# EAGLE schematic WiFi Pi (EAGLE 9.3.0)

## Sheet 1 of 8: Compute Module 4 Interface
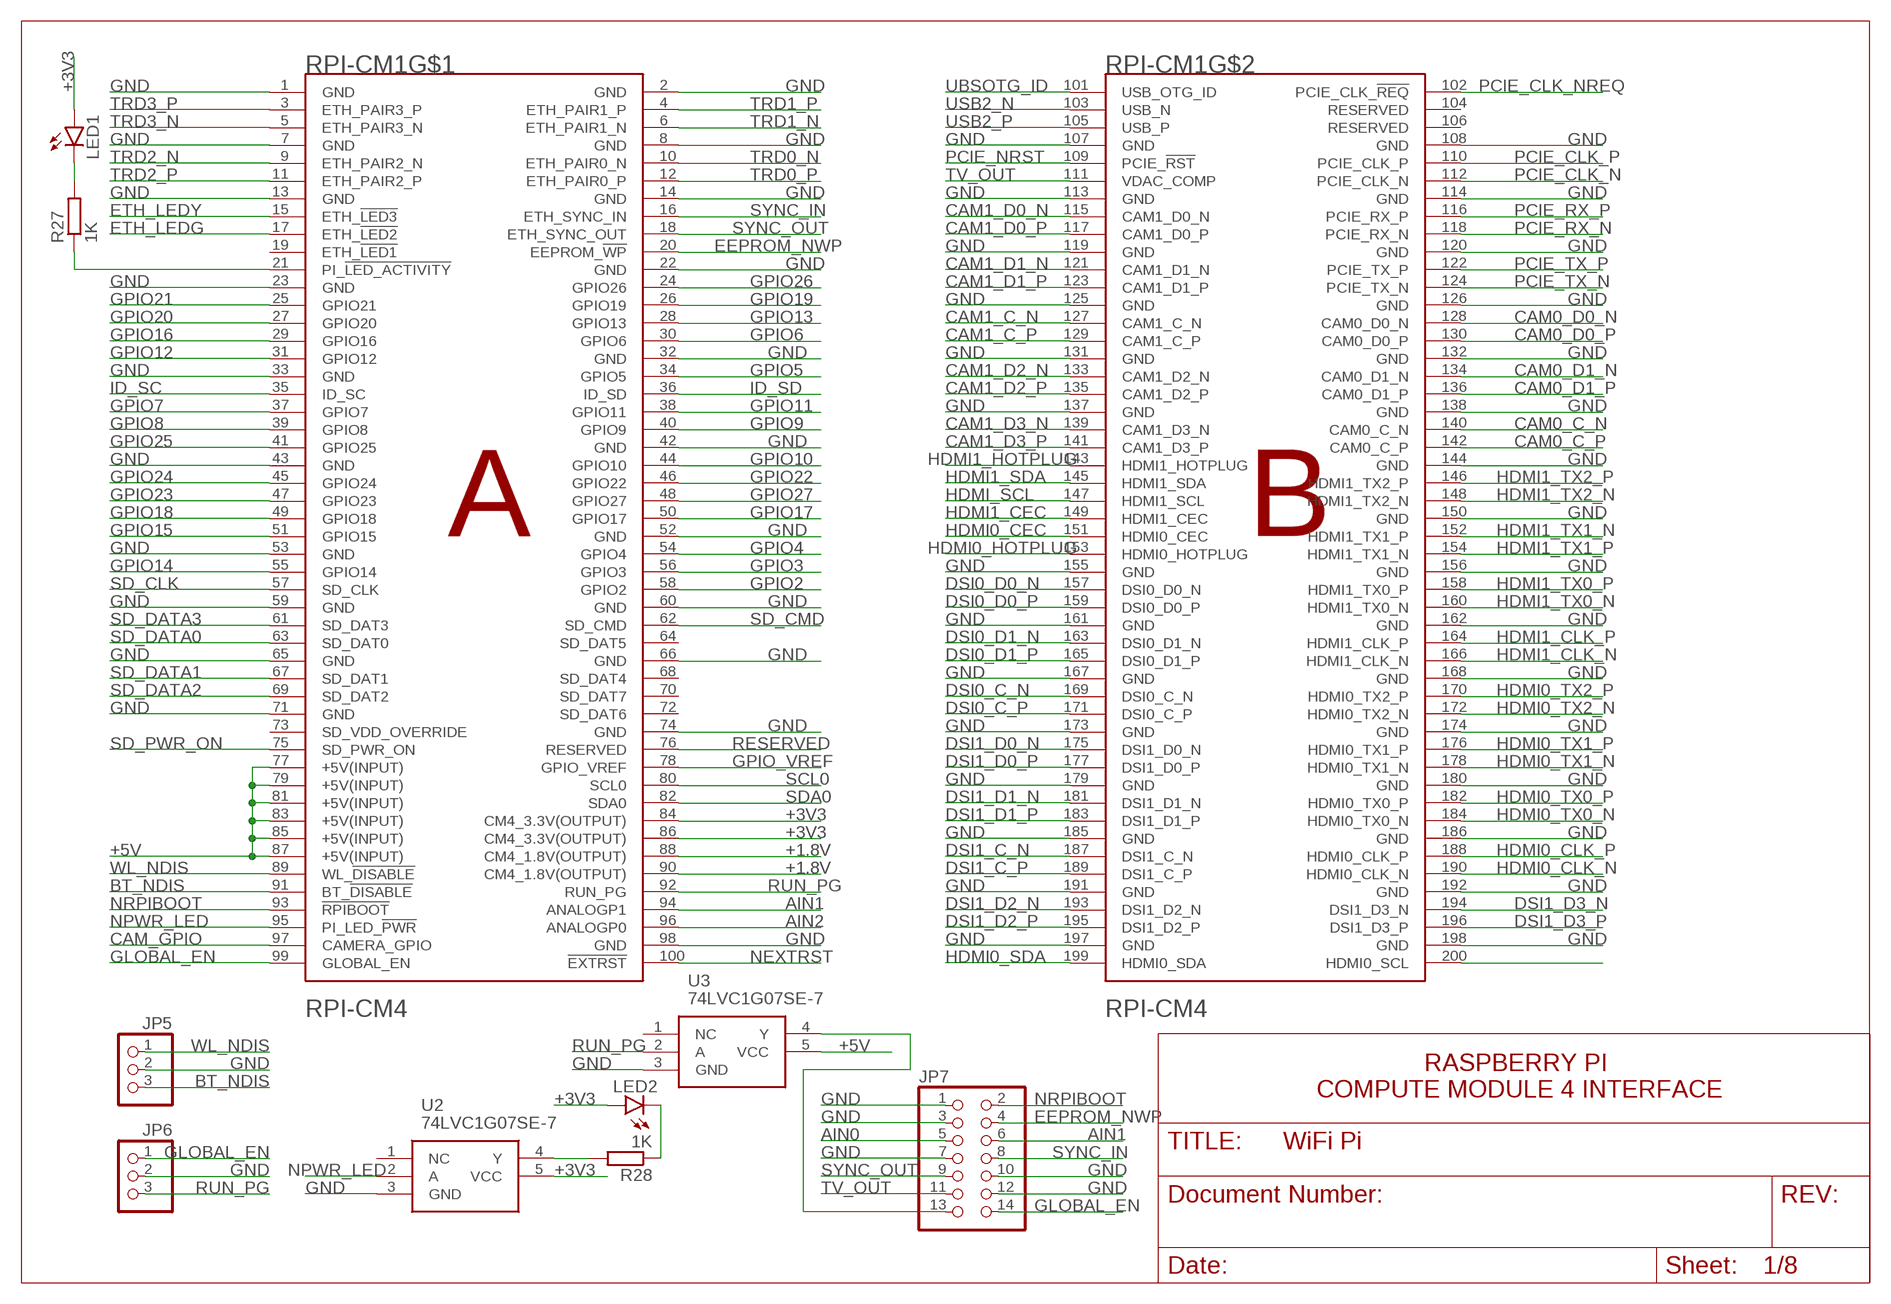
[diagram p0: schematic, sheet 1]

### Parts
JP5  PINHD-1X3  [1X03]
JP6  PINHD-1X3  [1X03]
JP7  PINHD-2X7  [2X07]
LED1  LEDCHIP-LED0805  [CHIP-LED0805]
LED2  LEDCHIP-LED0805  [CHIP-LED0805]
R27  1K  R-EU_M0805  [M0805]
R28  1K  R-EU_M0805  [M0805]
RPI-CM1  RPI-CM4  [RPI-CM4]
U2  74LVC1G07SE-7  [SOT65P210X110-5N]
U3  74LVC1G07SE-7  [SOT65P210X110-5N]

### Nets
+1.8V: RPI-CM1.88(CM4_1.8V(OUTPUT)) RPI-CM1.90(CM4_1.8V(OUTPUT)) ; also sheet 6
+3V3: LED1.A LED2.A RPI-CM1.84(CM4_3.3V(OUTPUT)) RPI-CM1.86(CM4_3.3V(OUTPUT)) U2.5(VCC) ; also sheet 4,5,6,7,8
+5V: RPI-CM1.77(+5V(INPUT)) RPI-CM1.79(+5V(INPUT)) RPI-CM1.81(+5V(INPUT)) RPI-CM1.83(+5V(INPUT)) RPI-CM1.85(+5V(INPUT)) RPI-CM1.87(+5V(INPUT)) U3.5(VCC) ; also sheet 2,5,6
AIN0: JP7.5
AIN1: JP7.6 RPI-CM1.94(ANALOGP1)
AIN2: RPI-CM1.96(ANALOGP0)
BT_NDIS: JP5.3 RPI-CM1.91(BT_!DISABLE)
CAM0_C_N: RPI-CM1.140(CAM0_C_N) ; also sheet 8
CAM0_C_P: RPI-CM1.142(CAM0_C_P) ; also sheet 8
CAM0_D0_N: RPI-CM1.128(CAM0_D0_N) ; also sheet 8
CAM0_D0_P: RPI-CM1.130(CAM0_D0_P) ; also sheet 8
CAM0_D1_N: RPI-CM1.134(CAM0_D1_N) ; also sheet 8
CAM0_D1_P: RPI-CM1.136(CAM0_D1_P) ; also sheet 8
CAM1_C_N: RPI-CM1.127(CAM1_C_N) ; also sheet 8
CAM1_C_P: RPI-CM1.129(CAM1_C_P) ; also sheet 8
CAM1_D0_N: RPI-CM1.115(CAM1_D0_N) ; also sheet 8
CAM1_D0_P: RPI-CM1.117(CAM1_D0_P) ; also sheet 8
CAM1_D1_N: RPI-CM1.121(CAM1_D1_N) ; also sheet 8
CAM1_D1_P: RPI-CM1.123(CAM1_D1_P) ; also sheet 8
CAM1_D2_N: RPI-CM1.133(CAM1_D2_N) ; also sheet 8
CAM1_D2_P: RPI-CM1.135(CAM1_D2_P) ; also sheet 8
CAM1_D3_N: RPI-CM1.139(CAM1_D3_N) ; also sheet 8
CAM1_D3_P: RPI-CM1.141(CAM1_D3_P) ; also sheet 8
CAM_GPIO: RPI-CM1.97(CAMERA_GPIO) ; also sheet 8
DSI0_C_N: RPI-CM1.169(DSI0_C_N) ; also sheet 8
DSI0_C_P: RPI-CM1.171(DSI0_C_P) ; also sheet 8
DSI0_D0_N: RPI-CM1.157(DSI0_D0_N) ; also sheet 8
DSI0_D0_P: RPI-CM1.159(DSI0_D0_P) ; also sheet 8
DSI0_D1_N: RPI-CM1.163(DSI0_D1_N) ; also sheet 8
DSI0_D1_P: RPI-CM1.165(DSI0_D1_P) ; also sheet 8
DSI1_C_N: RPI-CM1.187(DSI1_C_N) ; also sheet 8
DSI1_C_P: RPI-CM1.189(DSI1_C_P) ; also sheet 8
DSI1_D0_N: RPI-CM1.175(DSI1_D0_N) ; also sheet 8
DSI1_D0_P: RPI-CM1.177(DSI1_D0_P) ; also sheet 8
DSI1_D1_N: RPI-CM1.181(DSI1_D1_N) ; also sheet 8
DSI1_D1_P: RPI-CM1.183(DSI1_D1_P) ; also sheet 8
DSI1_D2_N: RPI-CM1.193(DSI1_D2_N) ; also sheet 8
DSI1_D2_P: RPI-CM1.195(DSI1_D2_P) ; also sheet 8
DSI1_D3_N: RPI-CM1.194(DSI1_D3_N) ; also sheet 8
DSI1_D3_P: RPI-CM1.196(DSI1_D3_P) ; also sheet 8
EEPROM_NWP: JP7.4 RPI-CM1.20(EEPROM_!WP)
ETH_LEDG: RPI-CM1.17(ETH_!LED2) ; also sheet 6
ETH_LEDY: RPI-CM1.15(ETH_!LED3) ; also sheet 6
GLOBAL_EN: JP6.1 JP7.14 RPI-CM1.99(GLOBAL_EN)
GND: JP5.2 JP6.2 JP7.1 JP7.3 JP7.7 JP7.10 JP7.12 RPI-CM1.1(GND) RPI-CM1.2(GND) RPI-CM1.7(GND) RPI-CM1.8(GND) RPI-CM1.13(GND) RPI-CM1.14(GND) RPI-CM1.22(GND) RPI-CM1.23(GND) RPI-CM1.32(GND) RPI-CM1.33(GND) RPI-CM1.42(GND) RPI-CM1.43(GND) RPI-CM1.52(GND) RPI-CM1.53(GND) RPI-CM1.59(GND) RPI-CM1.60(GND) RPI-CM1.65(GND) RPI-CM1.66(GND) RPI-CM1.71(GND) RPI-CM1.74(GND) RPI-CM1.98(GND) RPI-CM1.107(GND) RPI-CM1.108(GND) RPI-CM1.113(GND) RPI-CM1.114(GND) RPI-CM1.119(GND) RPI-CM1.120(GND) RPI-CM1.125(GND) RPI-CM1.126(GND) RPI-CM1.131(GND) RPI-CM1.132(GND) RPI-CM1.137(GND) RPI-CM1.138(GND) RPI-CM1.144(GND) RPI-CM1.150(GND) RPI-CM1.155(GND) RPI-CM1.156(GND) RPI-CM1.161(GND) RPI-CM1.162(GND) RPI-CM1.167(GND) RPI-CM1.168(GND) RPI-CM1.173(GND) RPI-CM1.174(GND) RPI-CM1.179(GND) RPI-CM1.180(GND) RPI-CM1.185(GND) RPI-CM1.186(GND) RPI-CM1.191(GND) RPI-CM1.192(GND) RPI-CM1.197(GND) RPI-CM1.198(GND) U2.3(GND) U3.3(GND) ; also sheet 2,4,5,6,7,8
GPIO2: RPI-CM1.58(GPIO2) ; also sheet 6
GPIO3: RPI-CM1.56(GPIO3) ; also sheet 6
GPIO4: RPI-CM1.54(GPIO4) ; also sheet 6
GPIO5: RPI-CM1.34(GPIO5) ; also sheet 6
GPIO6: RPI-CM1.30(GPIO6) ; also sheet 6
GPIO7: RPI-CM1.37(GPIO7) ; also sheet 6
GPIO8: RPI-CM1.39(GPIO8) ; also sheet 6
GPIO9: RPI-CM1.40(GPIO9) ; also sheet 6
GPIO10: RPI-CM1.44(GPIO10) ; also sheet 6
GPIO11: RPI-CM1.38(GPIO11) ; also sheet 6
GPIO12: RPI-CM1.31(GPIO12) ; also sheet 6
GPIO13: RPI-CM1.28(GPIO13) ; also sheet 6
GPIO14: RPI-CM1.55(GPIO14) ; also sheet 6
GPIO15: RPI-CM1.51(GPIO15) ; also sheet 6
GPIO16: RPI-CM1.29(GPIO16) ; also sheet 6
GPIO17: RPI-CM1.50(GPIO17) ; also sheet 6
GPIO18: RPI-CM1.49(GPIO18) ; also sheet 6
GPIO19: RPI-CM1.26(GPIO19) ; also sheet 6
GPIO20: RPI-CM1.27(GPIO20) ; also sheet 6
GPIO21: RPI-CM1.25(GPIO21) ; also sheet 6
GPIO22: RPI-CM1.46(GPIO22) ; also sheet 6
GPIO23: RPI-CM1.47(GPIO23) ; also sheet 6
GPIO24: RPI-CM1.45(GPIO24) ; also sheet 6
GPIO25: RPI-CM1.41(GPIO25) ; also sheet 6
GPIO26: RPI-CM1.24(GPIO26) ; also sheet 6
GPIO27: RPI-CM1.48(GPIO27) ; also sheet 6
GPIO_VREF: RPI-CM1.78(GPIO_VREF) ; also sheet 6,8
HDMI0_CEC: RPI-CM1.151(HDMI0_CEC) ; also sheet 8
HDMI0_CLK_N: RPI-CM1.190(HDMI0_CLK_N)
HDMI0_CLK_P: RPI-CM1.188(HDMI0_CLK_P)
HDMI0_HOTPLUG: RPI-CM1.153(HDMI0_HOTPLUG) ; also sheet 8
HDMI0_SDA: RPI-CM1.199(HDMI0_SDA) ; also sheet 8
HDMI0_TX0_N: RPI-CM1.184(HDMI0_TX0_N)
HDMI0_TX0_P: RPI-CM1.182(HDMI0_TX0_P)
HDMI0_TX1_N: RPI-CM1.178(HDMI0_TX1_N)
HDMI0_TX1_P: RPI-CM1.176(HDMI0_TX1_P)
HDMI0_TX2_N: RPI-CM1.172(HDMI0_TX2_N)
HDMI0_TX2_P: RPI-CM1.170(HDMI0_TX2_P)
HDMI1_CEC: RPI-CM1.149(HDMI1_CEC) ; also sheet 8
HDMI1_CLK_N: RPI-CM1.166(HDMI1_CLK_N)
HDMI1_CLK_P: RPI-CM1.164(HDMI1_CLK_P)
HDMI1_HOTPLUG: RPI-CM1.143(HDMI1_HOTPLUG) ; also sheet 8
HDMI1_SDA: RPI-CM1.145(HDMI1_SDA) ; also sheet 8
HDMI1_TX0_N: RPI-CM1.160(HDMI1_TX0_N)
HDMI1_TX0_P: RPI-CM1.158(HDMI1_TX0_P)
HDMI1_TX1_N: RPI-CM1.152(HDMI1_TX1_P)
HDMI1_TX1_P: RPI-CM1.154(HDMI1_TX1_N)
HDMI1_TX2_N: RPI-CM1.148(HDMI1_TX2_N)
HDMI1_TX2_P: RPI-CM1.146(HDMI1_TX2_P)
HDMI_SCL: RPI-CM1.147(HDMI1_SCL)
ID_SC: RPI-CM1.35(ID_SC) ; also sheet 6,8
ID_SD: RPI-CM1.36(ID_SD) ; also sheet 6,8
N$25: LED1.C R27.2
N$26: R28.2 U2.4(Y)
N$27: LED2.C R28.1
N$34: JP7.13 U3.4(Y)
N$35: R27.1 RPI-CM1.21(PI_!LED_ACTIVITY)
N$72: RPI-CM1.200(HDMI0_SCL)
NEXTRST: RPI-CM1.100(!EXTRST)
NPWR_LED: RPI-CM1.95(PI_LED_!PWR) U2.2(A)
NRPIBOOT: JP7.2 RPI-CM1.93(!RPIBOOT)
PCIE_CLK_N: RPI-CM1.112(PCIE_CLK_N)
PCIE_CLK_NREQ: RPI-CM1.102(PCIE_CLK_!REQ)
PCIE_CLK_P: RPI-CM1.110(PCIE_CLK_P)
PCIE_NRST: RPI-CM1.109(PCIE_!RST)
PCIE_RX_N: RPI-CM1.118(PCIE_RX_N)
PCIE_RX_P: RPI-CM1.116(PCIE_RX_P)
PCIE_TX_N: RPI-CM1.124(PCIE_TX_N)
PCIE_TX_P: RPI-CM1.122(PCIE_TX_P)
RESERVED: RPI-CM1.76(RESERVED) ; also sheet 6
RUN_PG: JP6.3 RPI-CM1.92(RUN_PG) U3.2(A)
SCL0: RPI-CM1.80(SCL0) ; also sheet 8
SD_CLK: RPI-CM1.57(SD_CLK) ; also sheet 6
SD_CMD: RPI-CM1.62(SD_CMD) ; also sheet 6
SD_DATA0: RPI-CM1.63(SD_DAT0)
SD_DATA1: RPI-CM1.67(SD_DAT1)
SD_DATA2: RPI-CM1.69(SD_DAT2)
SD_DATA3: RPI-CM1.61(SD_DAT3)
SD_PWR_ON: RPI-CM1.75(SD_PWR_ON)
SDA0: RPI-CM1.82(SDA0) ; also sheet 8
SYNC_IN: JP7.8 RPI-CM1.16(ETH_SYNC_IN)
SYNC_OUT: JP7.9 RPI-CM1.18(ETH_SYNC_OUT)
TRD0_N: RPI-CM1.10(ETH_PAIR0_N) ; also sheet 6
TRD0_P: RPI-CM1.12(ETH_PAIR0_P) ; also sheet 6
TRD1_N: RPI-CM1.6(ETH_PAIR1_N) ; also sheet 6
TRD1_P: RPI-CM1.4(ETH_PAIR1_P) ; also sheet 6
TRD2_N: RPI-CM1.9(ETH_PAIR2_N) ; also sheet 6
TRD2_P: RPI-CM1.11(ETH_PAIR2_P) ; also sheet 6
TRD3_N: RPI-CM1.5(ETH_PAIR3_N) ; also sheet 6
TRD3_P: RPI-CM1.3(ETH_PAIR3_P) ; also sheet 6
TV_OUT: JP7.11 RPI-CM1.111(VDAC_COMP)
UBSOTG_ID: RPI-CM1.101(USB_OTG_ID)
USB2_N: RPI-CM1.103(USB_N) ; also sheet 5
USB2_P: RPI-CM1.105(USB_P) ; also sheet 5
WL_NDIS: JP5.1 RPI-CM1.89(WL_!DISABLE)
Unconnected: RPI-CM1.19(ETH_!LED1) RPI-CM1.64(SD_DAT5) RPI-CM1.68(SD_DAT4) RPI-CM1.70(SD_DAT7) RPI-CM1.72(SD_DAT6) RPI-CM1.73(SD_VDD_OVERRIDE) RPI-CM1.104(RESERVED) RPI-CM1.106(RESERVED) U2.1(NC) U3.1(NC)

### Notes on the sheet
- RASPBERRY PI 
  COMPUTE MODULE 4 INTERFACE

## Sheet 2 of 8: Power Delivery System
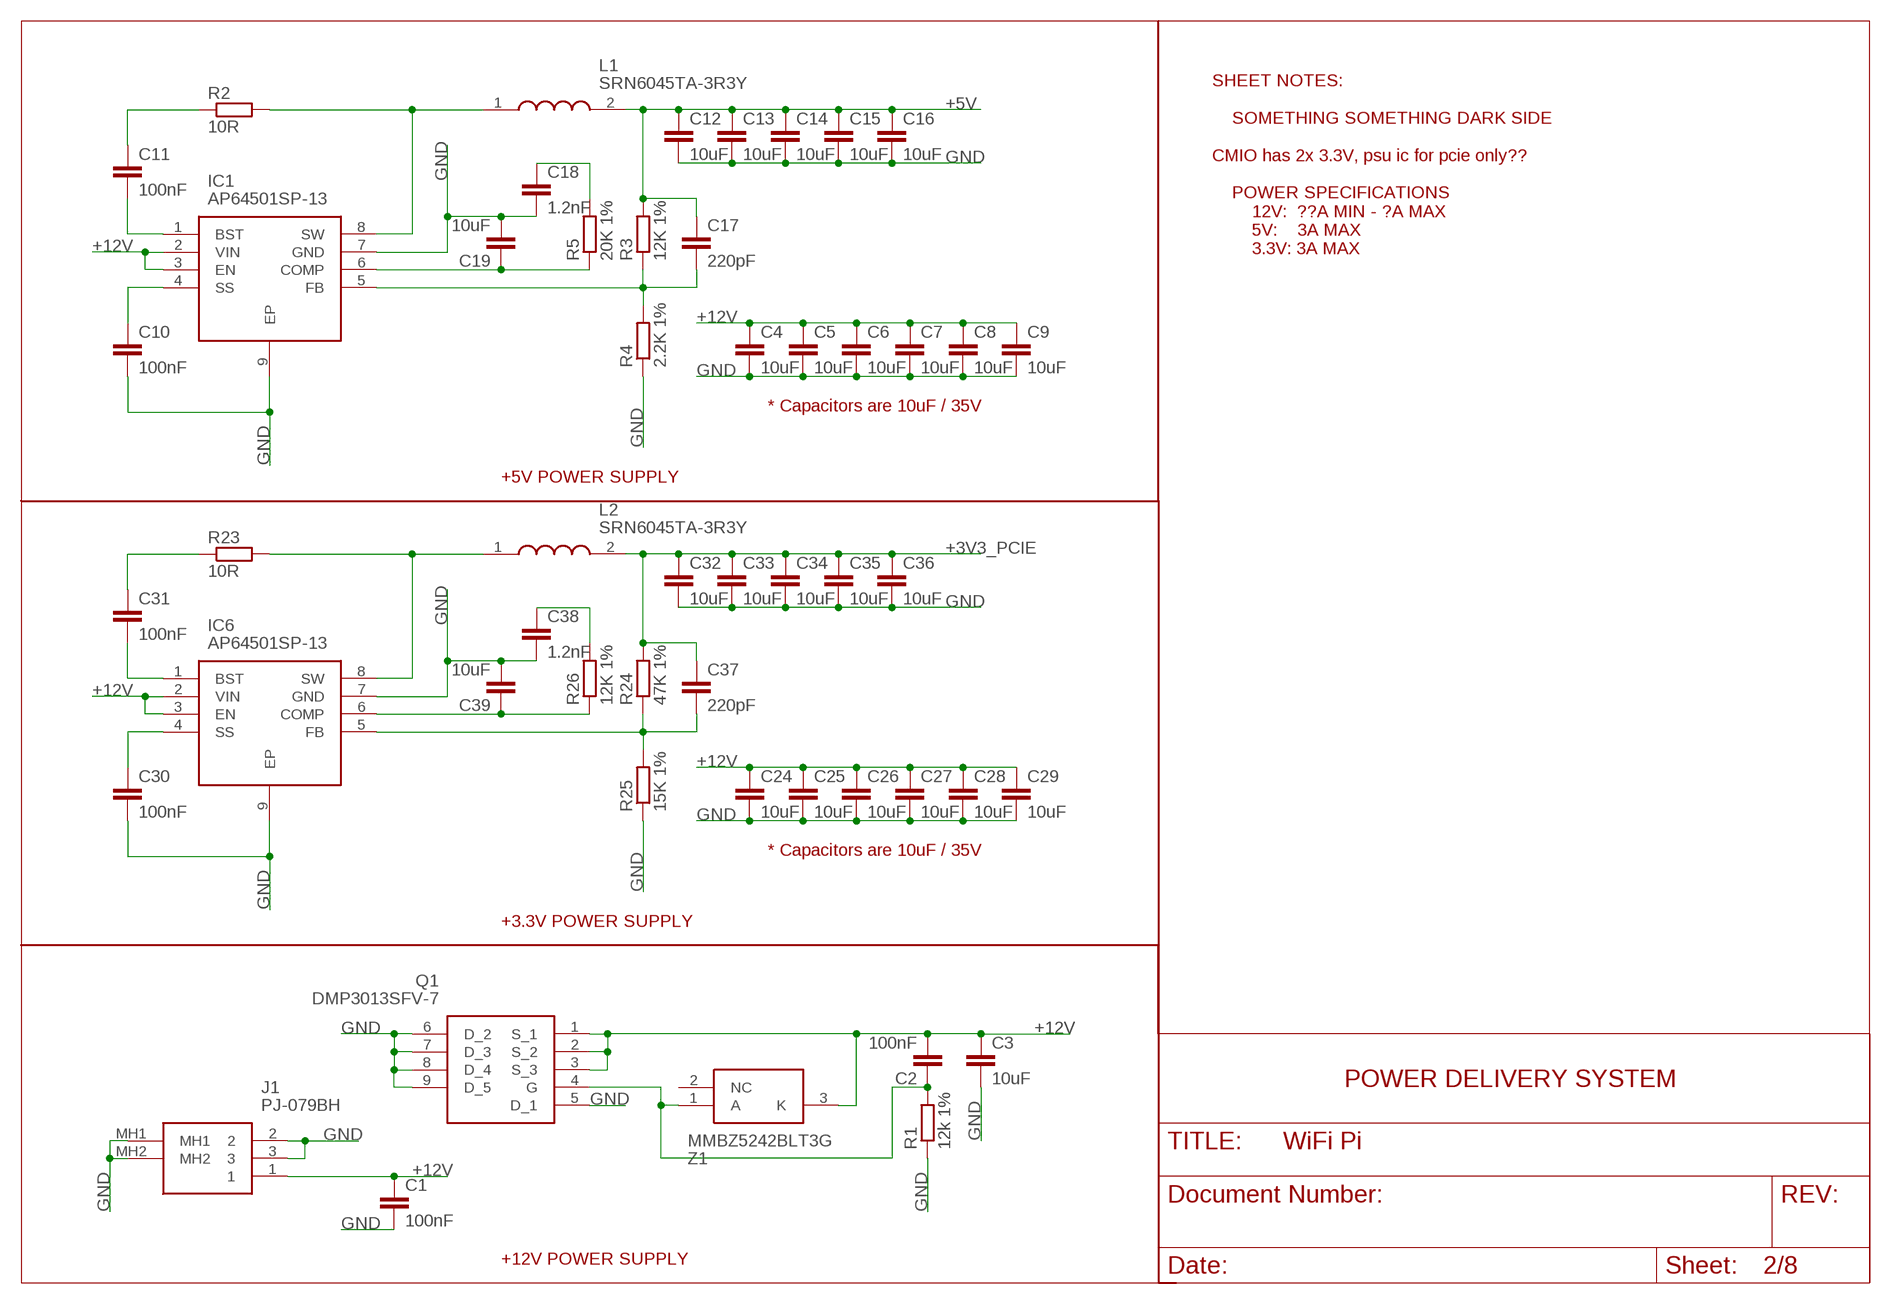
[diagram p1: schematic, sheet 2]

### Parts
C1  100nF  C-EUC0805K  [C0805K]
C2  100nF  C-EUC0805K  [C0805K]
C3  10uF  C-EUC0805K  [C0805K]
C4  10uF  C-EUC0805K  [C0805K]
C5  10uF  C-EUC0805K  [C0805K]
C6  10uF  C-EUC0805K  [C0805K]
C7  10uF  C-EUC0805K  [C0805K]
C8  10uF  C-EUC0805K  [C0805K]
C9  10uF  C-EUC0805K  [C0805K]
C10  100nF  C-EUC0805K  [C0805K]
C11  100nF  C-EUC0805K  [C0805K]
C12  10uF  C-EUC0805K  [C0805K]
C13  10uF  C-EUC0805K  [C0805K]
C14  10uF  C-EUC0805K  [C0805K]
C15  10uF  C-EUC0805K  [C0805K]
C16  10uF  C-EUC0805K  [C0805K]
C17  220pF  C-EUC0805K  [C0805K]
C18  1.2nF  C-EUC0805K  [C0805K]
C19  10uF  C-EUC0805K  [C0805K]
C24  10uF  C-EUC0805K  [C0805K]
C25  10uF  C-EUC0805K  [C0805K]
C26  10uF  C-EUC0805K  [C0805K]
C27  10uF  C-EUC0805K  [C0805K]
C28  10uF  C-EUC0805K  [C0805K]
C29  10uF  C-EUC0805K  [C0805K]
C30  100nF  C-EUC0805K  [C0805K]
C31  100nF  C-EUC0805K  [C0805K]
C32  10uF  C-EUC0805K  [C0805K]
C33  10uF  C-EUC0805K  [C0805K]
C34  10uF  C-EUC0805K  [C0805K]
C35  10uF  C-EUC0805K  [C0805K]
C36  10uF  C-EUC0805K  [C0805K]
C37  220pF  C-EUC0805K  [C0805K]
C38  1.2nF  C-EUC0805K  [C0805K]
C39  10uF  C-EUC0805K  [C0805K]
IC1  AP64501SP-13  [SOIC127P600X163-9N]
IC6  AP64501SP-13  [SOIC127P600X163-9N]
J1  PJ-079BH  [PJ079BH]
L1  SRN6045TA-3R3Y  [SRN6045TA330M]
L2  SRN6045TA-3R3Y  [SRN6045TA330M]
Q1  DMP3013SFV-7  [DMP3013SFV7]
R1  12k 1%  R-EU_M0805  [M0805]
R2  10R  R-EU_M0805  [M0805]
R3  12K 1%  R-EU_M0805  [M0805]
R4  2.2K 1%  R-EU_M0805  [M0805]
R5  20K 1%  R-EU_M0805  [M0805]
R23  10R  R-EU_M0805  [M0805]
R24  47K 1%  R-EU_M0805  [M0805]
R25  15K 1%  R-EU_M0805  [M0805]
R26  12K 1%  R-EU_M0805  [M0805]
Z1  MMBZ5242BLT3G  [SOT96P237X111-3N]

### Nets
+3V3_PCIE: C32.1 C33.1 C34.1 C35.1 C36.1 C37.1 L2.2 R24.2
+5V: C12.1 C13.1 C14.1 C15.1 C16.1 C17.1 L1.2 R3.2 ; also sheet 1,5,6
+12V: C1.1 C2.2 C3.1 C4.1 C5.1 C6.1 C7.1 C8.1 C9.1 C24.1 C25.1 C26.1 C27.1 C28.1 C29.1 IC1.2(VIN) IC1.3(EN) IC6.2(VIN) IC6.3(EN) J1.1 Q1.1(S_1) Q1.2(S_2) Q1.3(S_3) Z1.3(K) ; also sheet 7
GND: C1.2 C3.2 C4.2 C5.2 C6.2 C7.2 C8.2 C9.2 C10.2 C12.2 C13.2 C14.2 C15.2 C16.2 C18.2 C19.2 C24.2 C25.2 C26.2 C27.2 C28.2 C29.2 C30.2 C32.2 C33.2 C34.2 C35.2 C36.2 C38.2 C39.2 IC1.7(GND) IC1.9(EP) IC6.7(GND) IC6.9(EP) J1.2 J1.3 J1.MH1 J1.MH2 Q1.5(D_1) Q1.6(D_2) Q1.7(D_3) Q1.8(D_4) Q1.9(D_5) R1.1 R4.1 R25.1 ; also sheet 1,4,5,6,7,8
N$1: C2.1 Q1.4(G) R1.2 Z1.1(A)
N$2: C10.1 IC1.4(SS)
N$3: C11.2 IC1.1(BST)
N$4: C11.1 R2.1
N$5: IC1.8(SW) L1.1 R2.2
N$6: C19.1 IC1.6(COMP) R5.1
N$7: C17.2 IC1.5(FB) R3.1 R4.2
N$8: C18.1 R5.2
N$15: C30.1 IC6.4(SS)
N$17: C31.2 IC6.1(BST)
N$18: C31.1 R23.1
N$19: IC6.8(SW) L2.1 R23.2
N$20: C37.2 IC6.5(FB) R24.1 R25.2
N$22: C39.1 IC6.6(COMP) R26.1
N$24: C38.1 R26.2
Unconnected: Z1.2(NC)

### Notes on the sheet
- SHEET NOTES:
  
      SOMETHING SOMETHING DARK SIDE
  
  CMIO has 2x 3.3V, psu ic for pcie only??
  
      POWER SPECIFICATIONS
          12V:  ??A MIN - ?A MAX
          5V:    3A MAX
          3.3V: 3A MAX
- * Capacitors are 10uF / 35V
- +5V POWER SUPPLY
- * Capacitors are 10uF / 35V
- +3.3V POWER SUPPLY
- POWER DELIVERY SYSTEM
- +12V POWER SUPPLY

## Sheet 3 of 8: PCI-Express
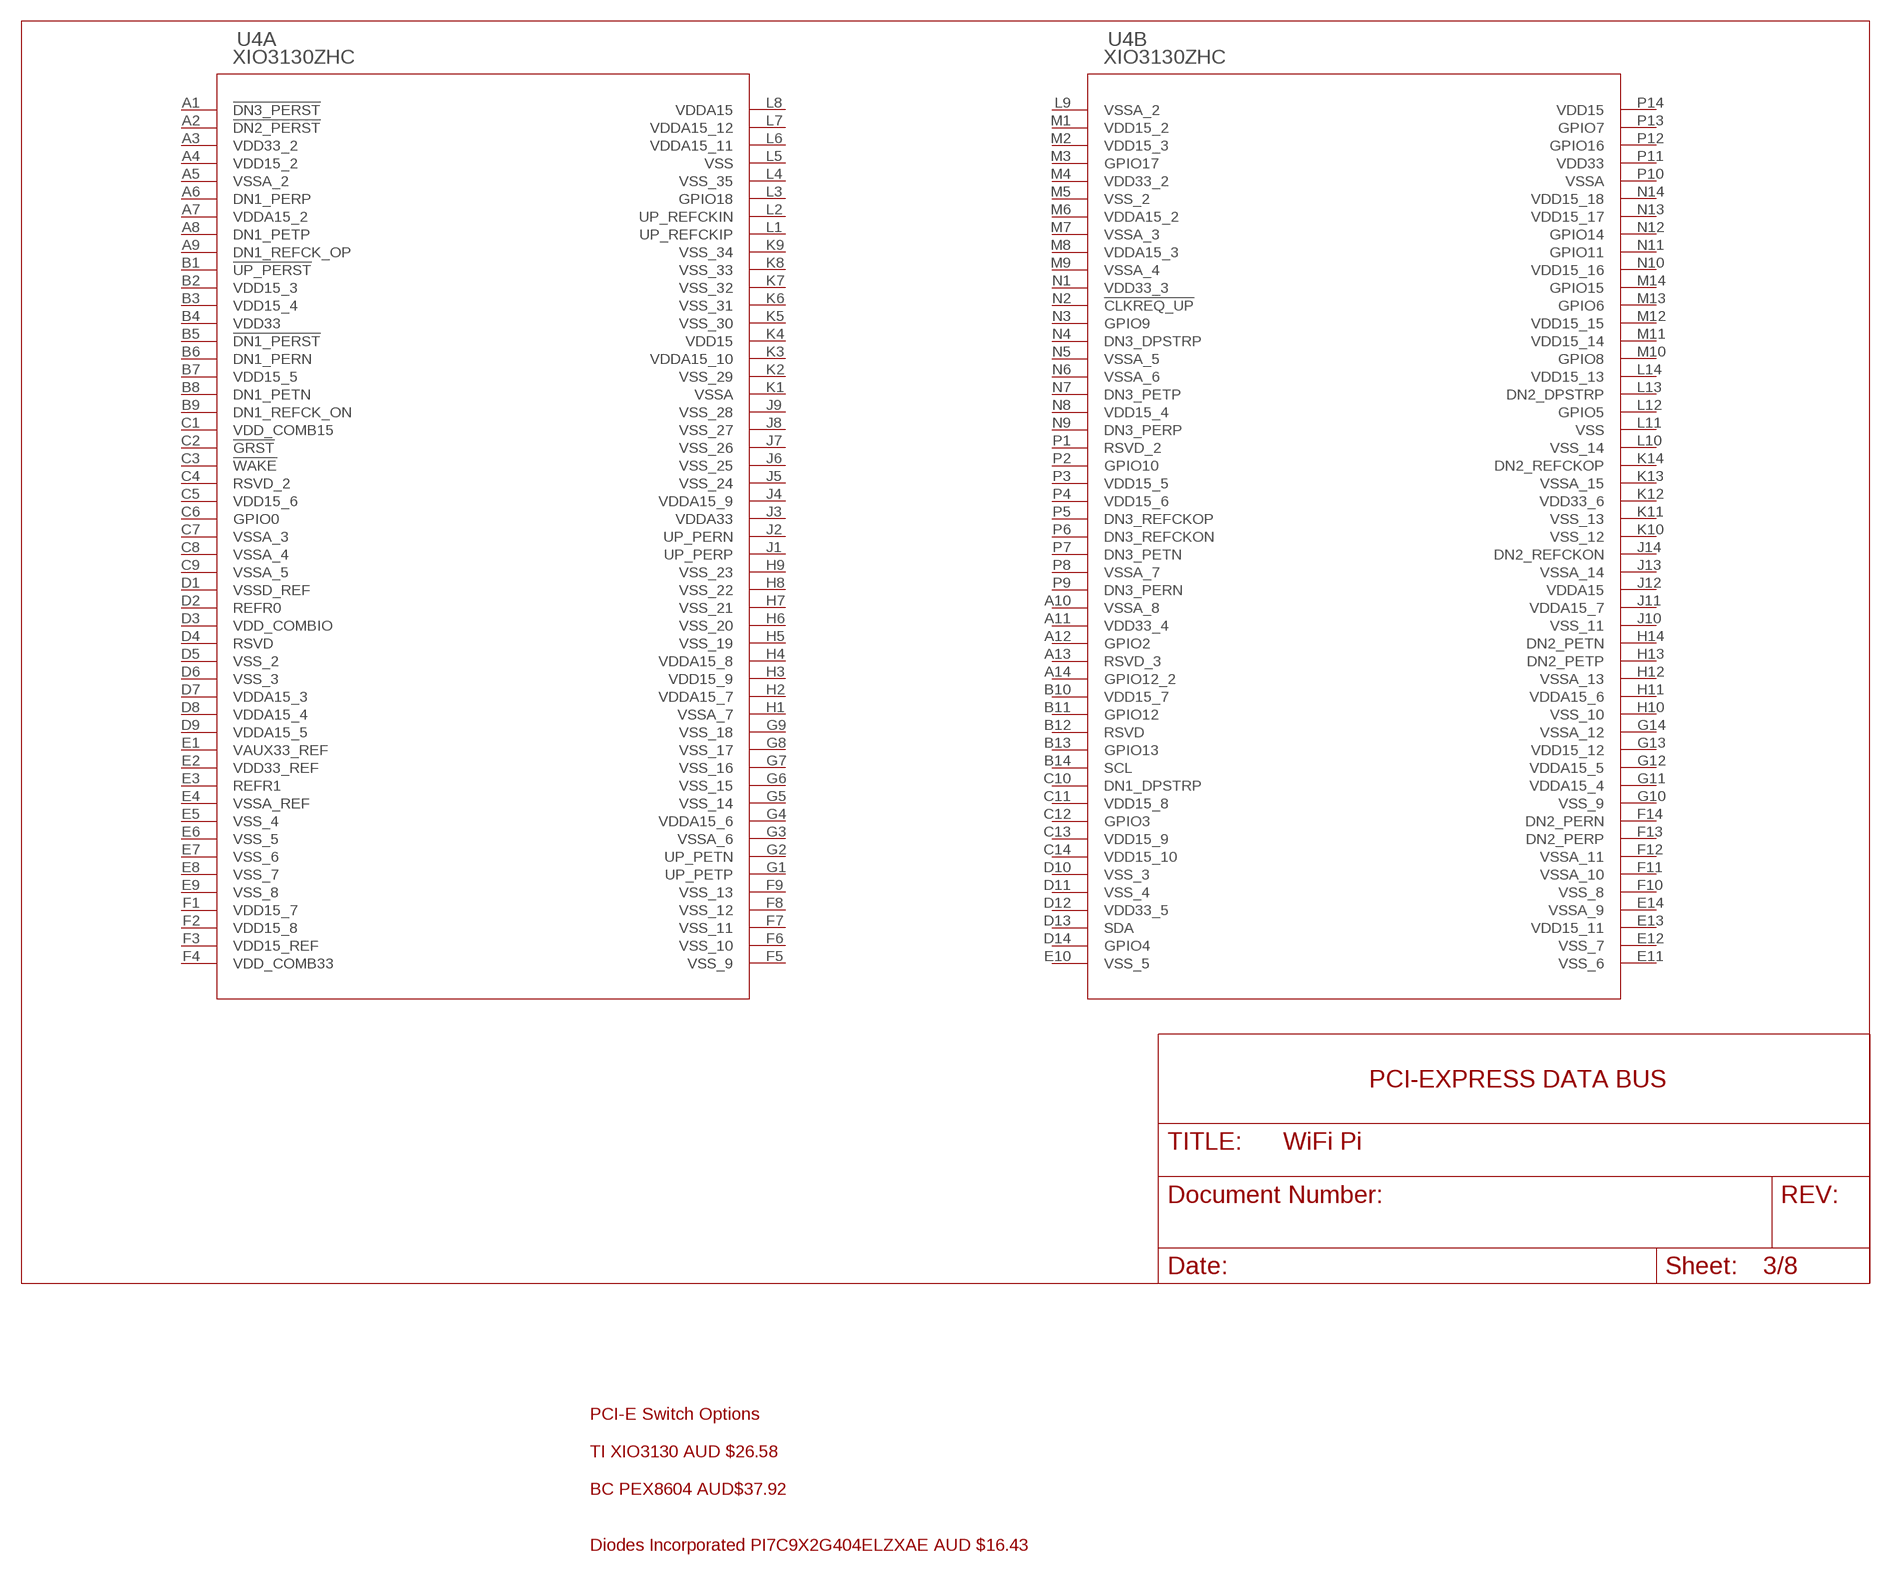
[diagram p2: schematic, sheet 3]

### Parts
U4  XIO3130ZHC  [ZHC196]
Unconnected: U4.A1(A:!DN3_PERST) U4.A2(A:!DN2_PERST) U4.A6(A:DN1_PERP) U4.A8(A:DN1_PETP) U4.A9(A:DN1_REFCK_OP) U4.A12(B:GPIO2) U4.A13(B:RSVD_3) U4.A14(B:GPIO12_2) U4.B1(A:!UP_PERST) U4.B5(A:!DN1_PERST) U4.B6(A:DN1_PERN) U4.B8(A:DN1_PETN) U4.B9(A:DN1_REFCK_ON) U4.B11(B:GPIO12) U4.B12(B:RSVD) U4.B13(B:GPIO13) U4.B14(B:SCL) U4.C2(A:!GRST) U4.C3(A:!WAKE) U4.C4(A:RSVD_2) U4.C6(A:GPIO0) U4.C10(B:DN1_DPSTRP) U4.C12(B:GPIO3) U4.D2(A:REFR0) U4.D4(A:RSVD) U4.D13(B:SDA) U4.D14(B:GPIO4) U4.E3(A:REFR1) U4.F13(B:DN2_PERP) U4.F14(B:DN2_PERN) U4.G1(A:UP_PETP) U4.G2(A:UP_PETN) U4.H13(B:DN2_PETP) U4.H14(B:DN2_PETN) U4.J1(A:UP_PERP) U4.J2(A:UP_PERN) U4.J14(B:DN2_REFCKON) U4.K14(B:DN2_REFCKOP) U4.L1(A:UP_REFCKIP) U4.L2(A:UP_REFCKIN) U4.L3(A:GPIO18) U4.L12(B:GPIO5) U4.L13(B:DN2_DPSTRP) U4.M3(B:GPIO17) U4.M10(B:GPIO8) U4.M13(B:GPIO6) U4.M14(B:GPIO15) U4.N2(B:!CLKREQ_UP) U4.N3(B:GPIO9) U4.N4(B:DN3_DPSTRP) U4.N7(B:DN3_PETP) U4.N9(B:DN3_PERP) U4.N11(B:GPIO11) U4.N12(B:GPIO14) U4.P1(B:RSVD_2) U4.P2(B:GPIO10) U4.P5(B:DN3_REFCKOP) U4.P6(B:DN3_REFCKON) U4.P7(B:DN3_PETN) U4.P9(B:DN3_PERN) U4.P12(B:GPIO16) U4.P13(B:GPIO7)

### Notes on the sheet
- PCI-EXPRESS DATA BUS
- PCI-E Switch Options
  
  TI XIO3130 AUD $26.58 
  
  BC PEX8604 AUD$37.92
  
  
  Diodes Incorporated PI7C9X2G404ELZXAE AUD $16.43

## Sheet 4 of 8: M.2 Interface
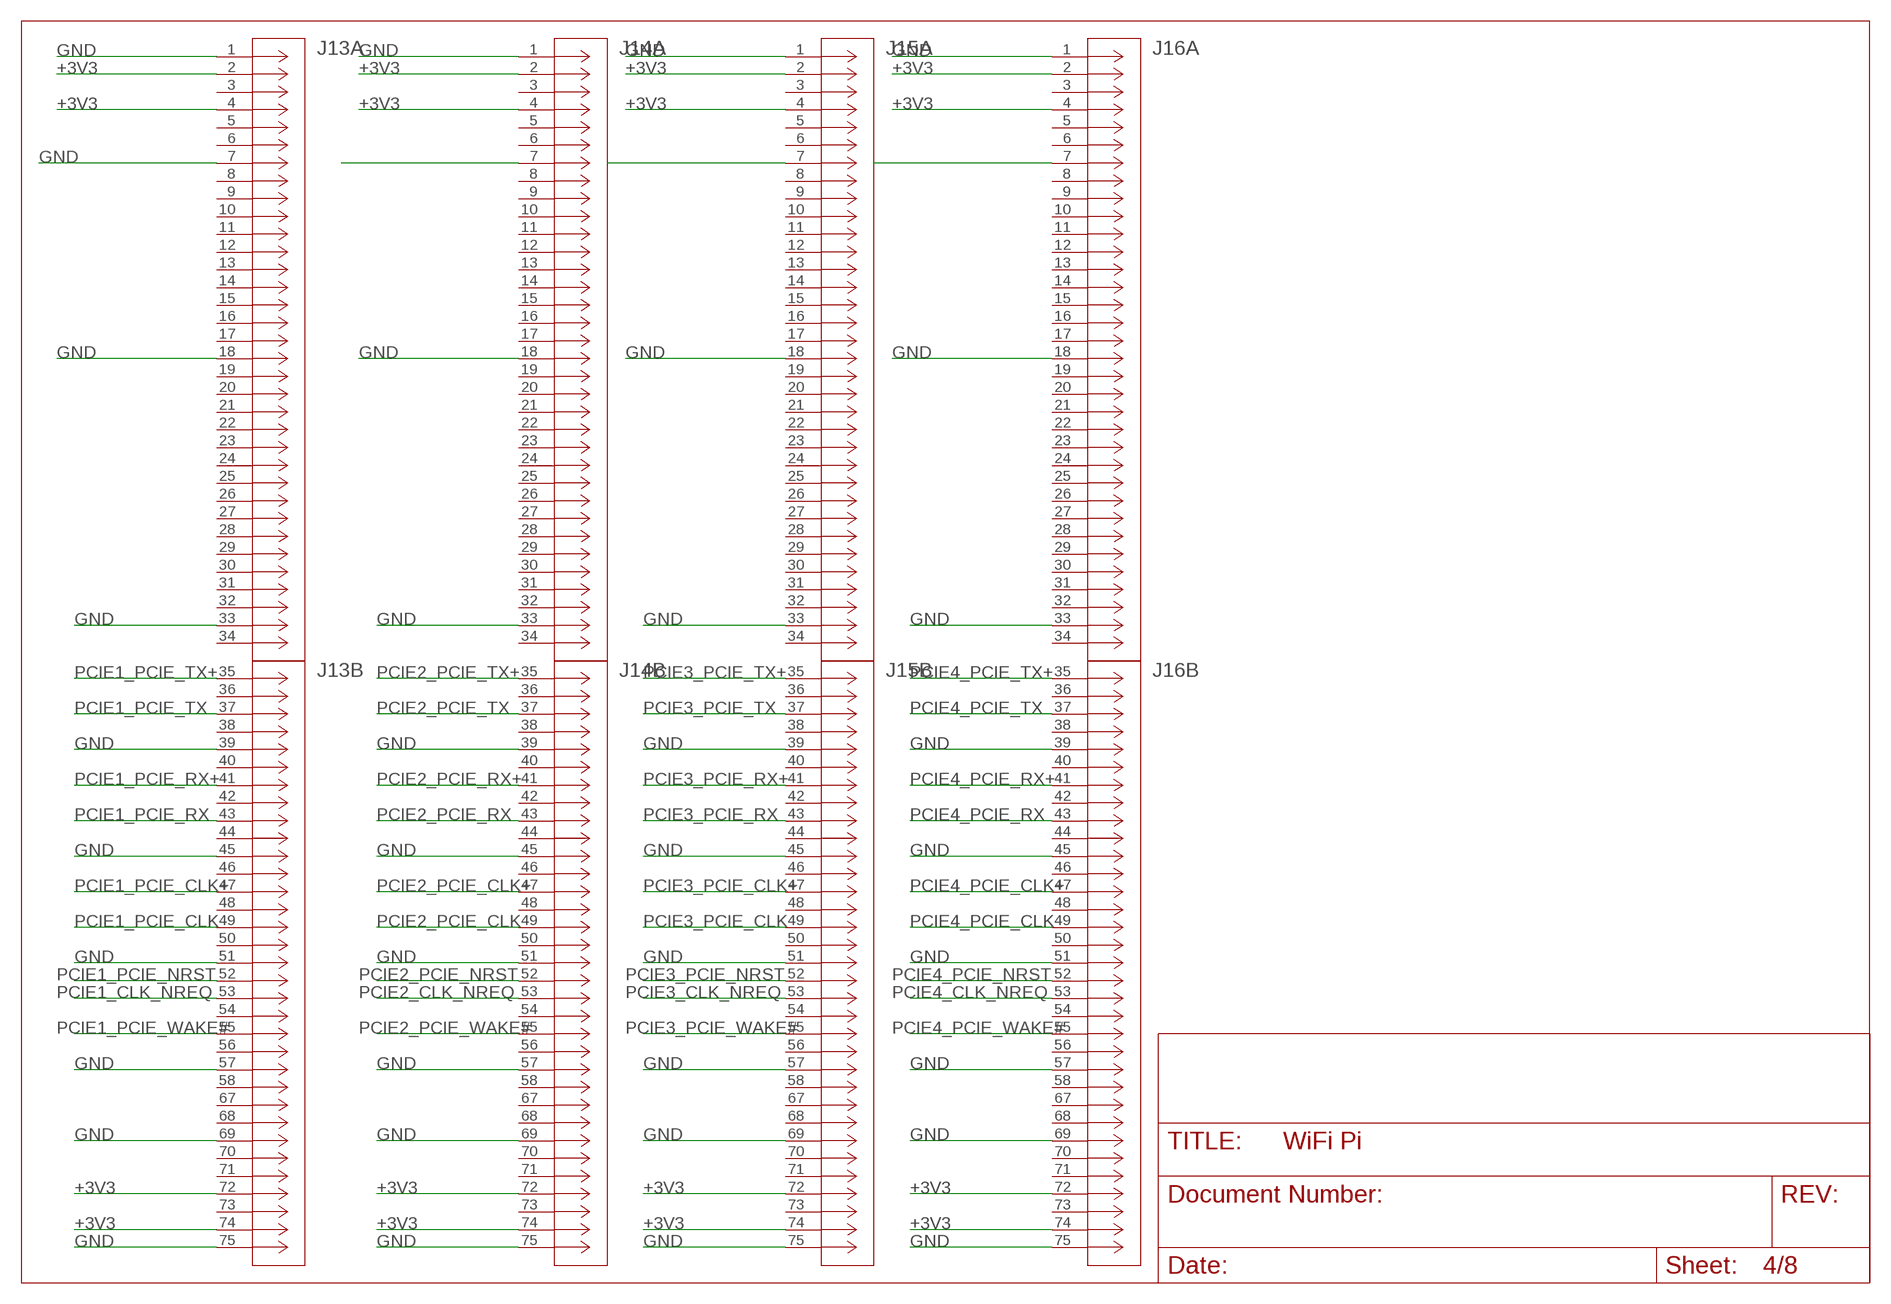
[diagram p3: schematic, sheet 4]

### Parts
J13  2199230-2  [CONN67_2199230_TEC]
J14  2199230-2  [CONN67_2199230_TEC]
J15  2199230-2  [CONN67_2199230_TEC]
J16  2199230-2  [CONN67_2199230_TEC]

### Nets
+3V3: J13.2 J13.4 J13.72 J13.74 J14.2 J14.4 J14.72 J14.74 J15.2 J15.4 J15.72 J15.74 J16.2 J16.4 J16.72 J16.74 ; also sheet 1,5,6,7,8
GND: J13.1 J13.7 J13.18 J13.33 J13.39 J13.45 J13.51 J13.57 J13.69 J13.75 J14.1 J14.7 J14.18 J14.33 J14.39 J14.45 J14.51 J14.57 J14.69 J14.75 J15.1 J15.7 J15.18 J15.33 J15.39 J15.45 J15.51 J15.57 J15.69 J15.75 J16.1 J16.7 J16.18 J16.33 J16.39 J16.45 J16.51 J16.57 J16.69 J16.75 ; also sheet 1,2,5,6,7,8
PCIE1_CLK_NREQ: J13.53
PCIE1_PCIE_CLK: J13.49
PCIE1_PCIE_CLK+: J13.47
PCIE1_PCIE_NRST: J13.52
PCIE1_PCIE_RX: J13.43
PCIE1_PCIE_RX+: J13.41
PCIE1_PCIE_TX: J13.37
PCIE1_PCIE_TX+: J13.35
PCIE1_PCIE_WAKE#: J13.55
PCIE2_CLK_NREQ: J14.53
PCIE2_PCIE_CLK: J14.49
PCIE2_PCIE_CLK+: J14.47
PCIE2_PCIE_NRST: J14.52
PCIE2_PCIE_RX: J14.43
PCIE2_PCIE_RX+: J14.41
PCIE2_PCIE_TX: J14.37
PCIE2_PCIE_TX+: J14.35
PCIE2_PCIE_WAKE#: J14.55
PCIE3_CLK_NREQ: J15.53
PCIE3_PCIE_CLK: J15.49
PCIE3_PCIE_CLK+: J15.47
PCIE3_PCIE_NRST: J15.52
PCIE3_PCIE_RX: J15.43
PCIE3_PCIE_RX+: J15.41
PCIE3_PCIE_TX: J15.37
PCIE3_PCIE_TX+: J15.35
PCIE3_PCIE_WAKE#: J15.55
PCIE4_CLK_NREQ: J16.53
PCIE4_PCIE_CLK: J16.49
PCIE4_PCIE_CLK+: J16.47
PCIE4_PCIE_NRST: J16.52
PCIE4_PCIE_RX: J16.43
PCIE4_PCIE_RX+: J16.41
PCIE4_PCIE_TX: J16.37
PCIE4_PCIE_TX+: J16.35
PCIE4_PCIE_WAKE#: J16.55
Unconnected: J13.3 J13.5 J13.6 J13.8 J13.9 J13.10 J13.11 J13.12 J13.13 J13.14 J13.15 J13.16 J13.17 J13.19 J13.20 J13.21 J13.22 J13.23 J13.24 J13.25 J13.26 J13.27 J13.28 J13.29 J13.30 J13.31 J13.32 J13.34 J13.36 J13.38 J13.40 J13.42 J13.44 J13.46 J13.48 J13.50 J13.54 J13.56 J13.58 J13.67 J13.68 J13.70 J13.71 J13.73 J14.3 J14.5 J14.6 J14.8 J14.9 J14.10 J14.11 J14.12 J14.13 J14.14 J14.15 J14.16 J14.17 J14.19 J14.20 J14.21 J14.22 J14.23 J14.24 J14.25 J14.26 J14.27 J14.28 J14.29 J14.30 J14.31 J14.32 J14.34 J14.36 J14.38 J14.40 J14.42 J14.44 J14.46 J14.48 J14.50 J14.54 J14.56 J14.58 J14.67 J14.68 J14.70 J14.71 J14.73 J15.3 J15.5 J15.6 J15.8 J15.9 J15.10 J15.11 J15.12 J15.13 J15.14 J15.15 J15.16 J15.17 J15.19 J15.20 J15.21 J15.22 J15.23 J15.24 J15.25 J15.26 J15.27 J15.28 J15.29 J15.30 J15.31 J15.32 J15.34 J15.36 J15.38 J15.40 J15.42 J15.44 J15.46 J15.48 J15.50 J15.54 J15.56 J15.58 J15.67 J15.68 J15.70 J15.71 J15.73 J16.3 J16.5 J16.6 J16.8 J16.9 J16.10 J16.11 J16.12 J16.13 J16.14 J16.15 J16.16 J16.17 J16.19 J16.20 J16.21 J16.22 J16.23 J16.24 J16.25 J16.26 J16.27 J16.28 J16.29 J16.30 J16.31 J16.32 J16.34 J16.36 J16.38 J16.40 J16.42 J16.44 J16.46 J16.48 J16.50 J16.54 J16.56 J16.58 J16.67 J16.68 J16.70 J16.71 J16.73

## Sheet 5 of 8: USB Interface
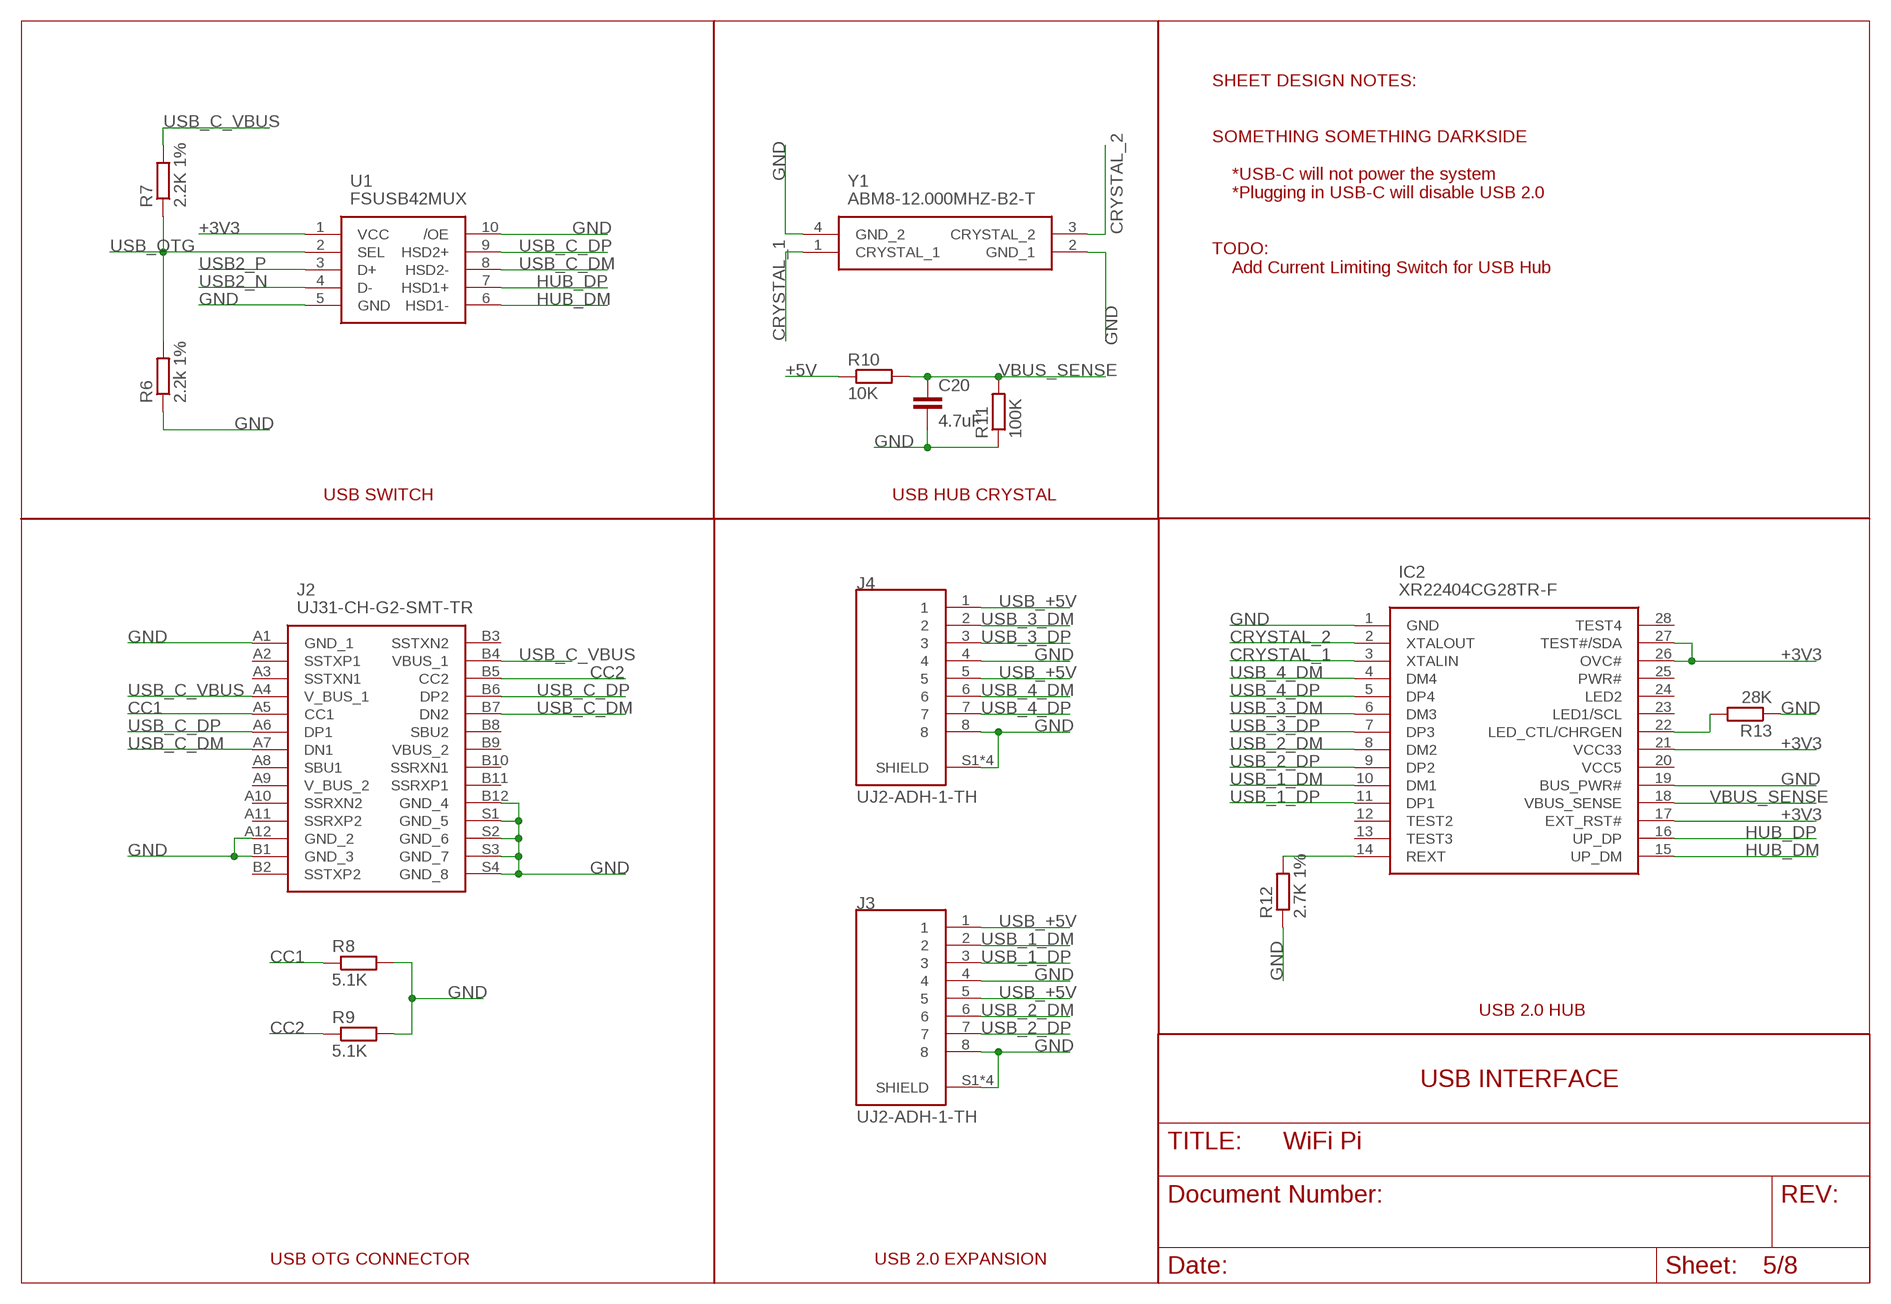
[diagram p4: schematic, sheet 5]

### Parts
C20  4.7uF  C-EUC0805K  [C0805K]
IC2  XR22404CG28TR-F  [SOP64P600X173-28N]
J2  UJ31-CH-G2-SMT-TR  [UJ31CHG2SMTTR]
J3  UJ2-ADH-1-TH  [CUI_UJ2-ADH-1-TH]
J4  UJ2-ADH-1-TH  [CUI_UJ2-ADH-1-TH]
R6  2.2k 1%  R-EU_M0805  [M0805]
R7  2.2K 1%  R-EU_M0805  [M0805]
R8  5.1K  R-EU_M0805  [M0805]
R9  5.1K  R-EU_M0805  [M0805]
R10  10K  R-EU_M0805  [M0805]
R11  100K  R-EU_M0805  [M0805]
R12  2.7K 1%  R-EU_M0805  [M0805]
R13  28K  R-EU_M0805  [M0805]
U1  FSUSB42MUX  [SOP50P490X110-10N]
Y1  ABM8-12.000MHZ-B2-T  [ABM812000MHZB2T]

### Nets
+3V3: IC2.17(EXT_RST#) IC2.21(VCC33) IC2.26(OVC#) IC2.27(TEST#/SDA) U1.1(VCC) ; also sheet 1,4,6,7,8
+5V: R10.1 ; also sheet 1,2,6
CC1: J2.A5(CC1) R8.1
CC2: J2.B5(CC2) R9.1
CRYSTAL_1: IC2.3(XTALIN) Y1.1(CRYSTAL_1)
CRYSTAL_2: IC2.2(XTALOUT) Y1.3(CRYSTAL_2)
GND: C20.2 IC2.1(GND) IC2.19(BUS_PWR#) J2.A1(GND_1) J2.A12(GND_2) J2.B1(GND_3) J2.B12(GND_4) J2.S1(GND_5) J2.S2(GND_6) J2.S3(GND_7) J2.S4(GND_8) J3.4 J3.8 J3.S1(SHIELD) J3.S2(SHIELD) J3.S3(SHIELD) J3.S4(SHIELD) J4.4 J4.8 J4.S1(SHIELD) J4.S2(SHIELD) J4.S3(SHIELD) J4.S4(SHIELD) R6.1 R8.2 R9.2 R11.1 R12.1 R13.1 U1.5(GND) U1.10(/OE) Y1.2(GND_1) Y1.4(GND_2) ; also sheet 1,2,4,6,7,8
HUB_DM: IC2.15(UP_DM) U1.6(HSD1-)
HUB_DP: IC2.16(UP_DP) U1.7(HSD1+)
N$21: IC2.14(REXT) R12.2
N$23: IC2.22(LED_CTL/CHRGEN) R13.2
USB2_N: U1.4(D-) ; also sheet 1
USB2_P: U1.3(D+) ; also sheet 1
USB_1_DM: IC2.10(DM1) J3.2
USB_1_DP: IC2.11(DP1) J3.3
USB_2_DM: IC2.8(DM2) J3.6
USB_2_DP: IC2.9(DP2) J3.7
USB_3_DM: IC2.6(DM3) J4.2
USB_3_DP: IC2.7(DP3) J4.3
USB_4_DM: IC2.4(DM4) J4.6
USB_4_DP: IC2.5(DP4) J4.7
USB_+5V: J3.1 J3.5 J4.1 J4.5
USB_C_DM: J2.A7(DN1) J2.B7(DN2) U1.8(HSD2-)
USB_C_DP: J2.A6(DP1) J2.B6(DP2) U1.9(HSD2+)
USB_C_VBUS: J2.A4(V_BUS_1) J2.B4(VBUS_1) R7.2
USB_OTG: R6.2 R7.1 U1.2(SEL)
VBUS_SENSE: C20.1 IC2.18(VBUS_SENSE) R10.2 R11.2
Unconnected: IC2.12(TEST2) IC2.13(TEST3) IC2.20(VCC5) IC2.23(LED1/SCL) IC2.24(LED2) IC2.25(PWR#) IC2.28(TEST4) J2.A2(SSTXP1) J2.A3(SSTXN1) J2.A8(SBU1) J2.A9(V_BUS_2) J2.A10(SSRXN2) J2.A11(SSRXP2) J2.B2(SSTXP2) J2.B3(SSTXN2) J2.B8(SBU2) J2.B9(VBUS_2) J2.B10(SSRXN1) J2.B11(SSRXP1)

### Notes on the sheet
- SHEET DESIGN NOTES:
  
  
  SOMETHING SOMETHING DARKSIDE
  
      *USB-C will not power the system
      *Plugging in USB-C will disable USB 2.0
  
  
  TODO:
      Add Current Limiting Switch for USB Hub
- USB SWITCH | USB HUB CRYSTAL
- USB 2.0 HUB
- USB INTERFACE
- USB OTG CONNECTOR | USB 2.0 EXPANSION

## Sheet 6 of 8: SD, Ethernet, GPIO
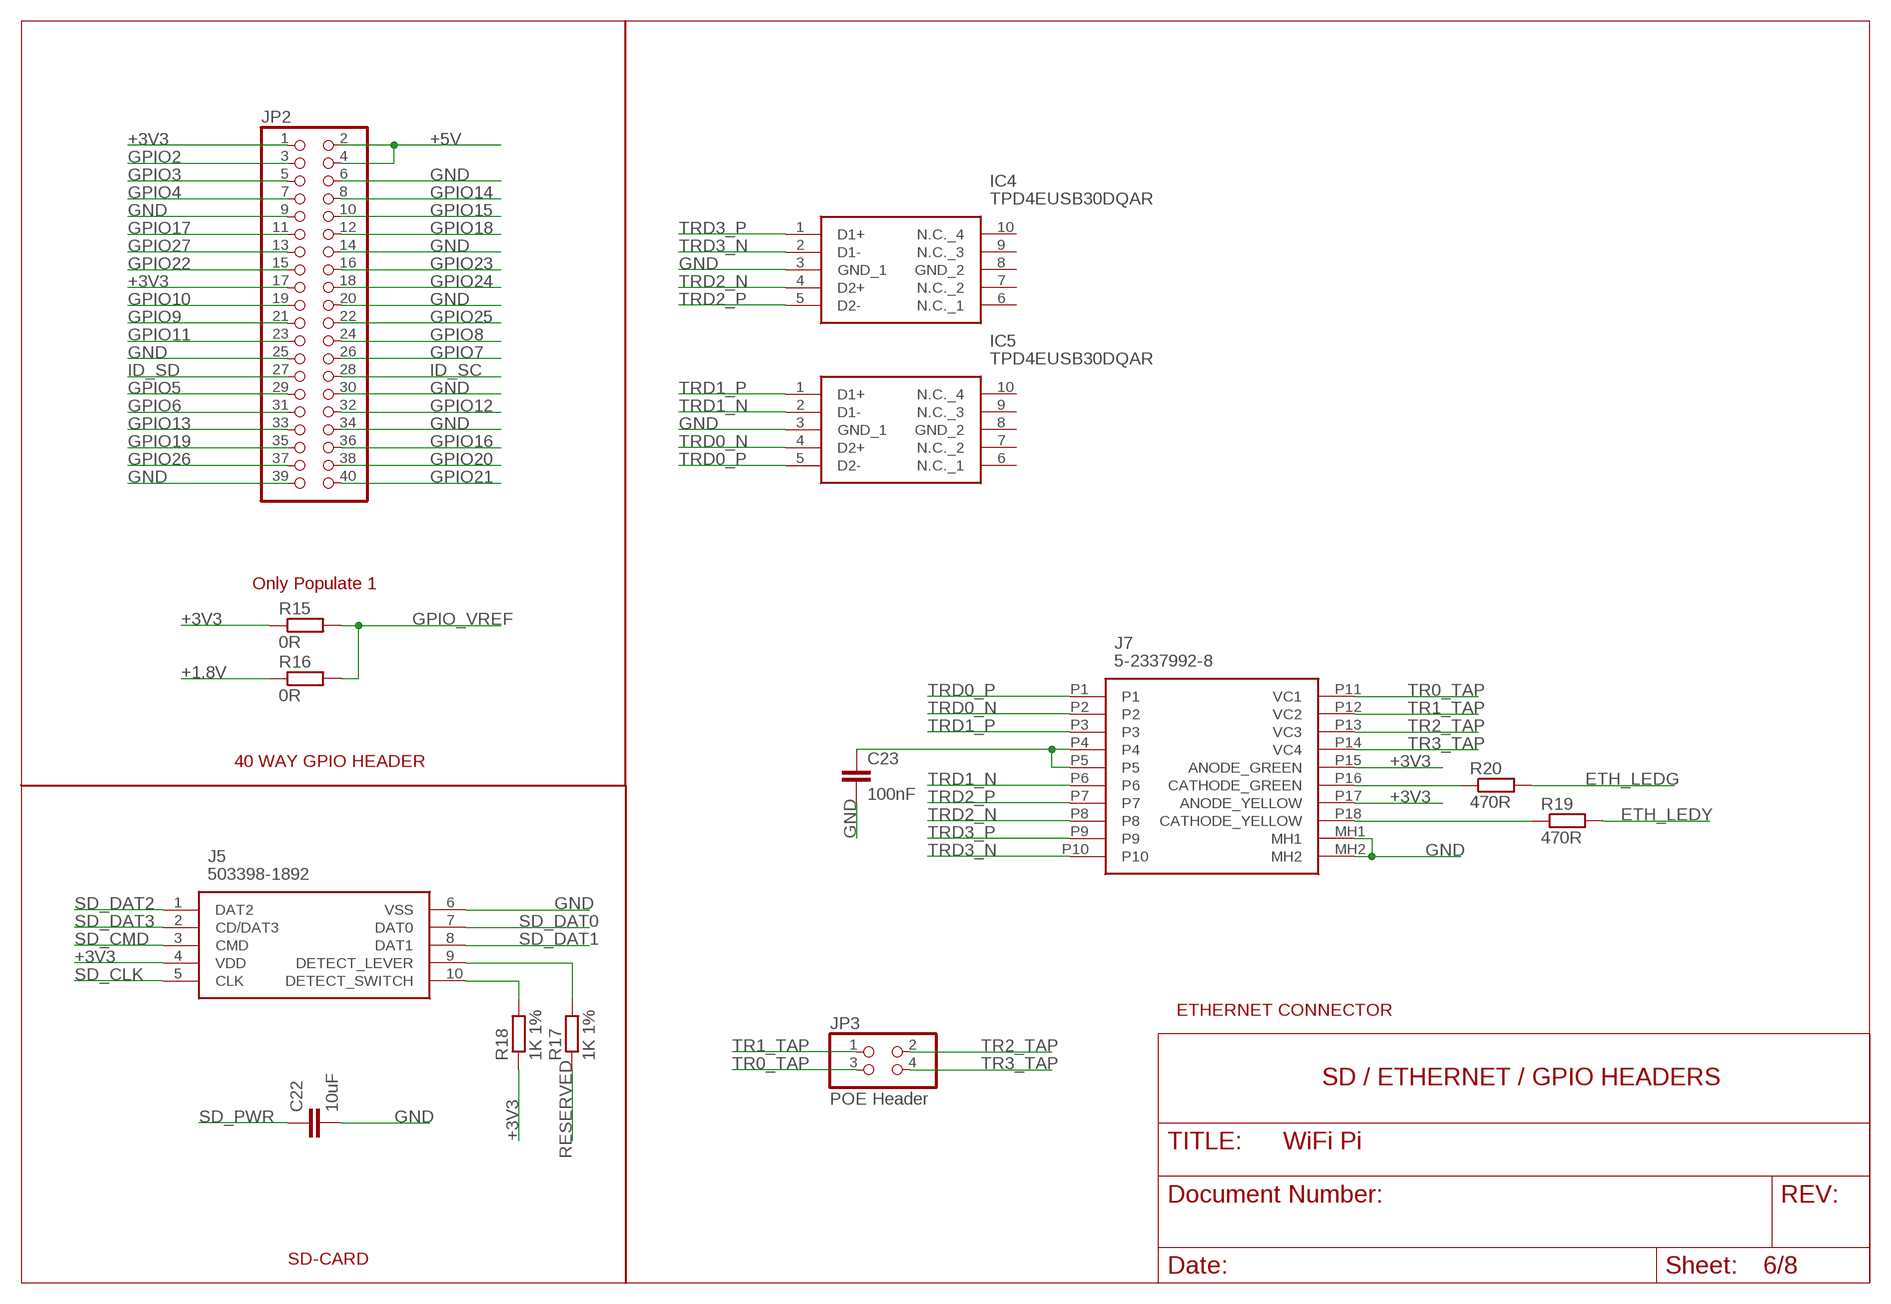
[diagram p5: schematic, sheet 6]

### Parts
C22  10uF  C-EUC0805K  [C0805K]
C23  100nF  C-EUC0805K  [C0805K]
IC4  TPD4EUSB30DQAR  [DQA(R-PUSON-N10)]
IC5  TPD4EUSB30DQAR  [DQA(R-PUSON-N10)]
J5  503398-1892  [503398-1892]
J7  5-2337992-8  [523379928]
JP2  PINHD-2X20  [2X20]
JP3  POE Header  PINHD-2X2  [2X02]
R15  0R  R-EU_M0805  [M0805]
R16  0R  R-EU_M0805  [M0805]
R17  1K 1%  R-EU_M0805  [M0805]
R18  1K 1%  R-EU_M0805  [M0805]
R19  470R  R-EU_M0805  [M0805]
R20  470R  R-EU_M0805  [M0805]

### Nets
+1.8V: R16.1 ; also sheet 1
+3V3: J5.4(VDD) J7.P15(ANODE_GREEN) J7.P17(ANODE_YELLOW) JP2.1 JP2.17 R15.1 R18.1 ; also sheet 1,4,5,7,8
+5V: JP2.2 JP2.4 ; also sheet 1,2,5
ETH_LEDG: R20.2 ; also sheet 1
ETH_LEDY: R19.2 ; also sheet 1
GND: C22.2 C23.2 IC4.3(GND_1) IC5.3(GND_1) J5.6(VSS) J7.MH1 J7.MH2 JP2.6 JP2.9 JP2.14 JP2.20 JP2.25 JP2.30 JP2.34 JP2.39 ; also sheet 1,2,4,5,7,8
GPIO2: JP2.3 ; also sheet 1
GPIO3: JP2.5 ; also sheet 1
GPIO4: JP2.7 ; also sheet 1
GPIO5: JP2.29 ; also sheet 1
GPIO6: JP2.31 ; also sheet 1
GPIO7: JP2.26 ; also sheet 1
GPIO8: JP2.24 ; also sheet 1
GPIO9: JP2.21 ; also sheet 1
GPIO10: JP2.19 ; also sheet 1
GPIO11: JP2.23 ; also sheet 1
GPIO12: JP2.32 ; also sheet 1
GPIO13: JP2.33 ; also sheet 1
GPIO14: JP2.8 ; also sheet 1
GPIO15: JP2.10 ; also sheet 1
GPIO16: JP2.36 ; also sheet 1
GPIO17: JP2.11 ; also sheet 1
GPIO18: JP2.12 ; also sheet 1
GPIO19: JP2.35 ; also sheet 1
GPIO20: JP2.38 ; also sheet 1
GPIO21: JP2.40 ; also sheet 1
GPIO22: JP2.15 ; also sheet 1
GPIO23: JP2.16 ; also sheet 1
GPIO24: JP2.18 ; also sheet 1
GPIO25: JP2.22 ; also sheet 1
GPIO26: JP2.37 ; also sheet 1
GPIO27: JP2.13 ; also sheet 1
GPIO_VREF: R15.2 R16.2 ; also sheet 1,8
ID_SC: JP2.28 ; also sheet 1,8
ID_SD: JP2.27 ; also sheet 1,8
N$11: J5.9(DETECT_LEVER) R17.2
N$12: J5.10(DETECT_SWITCH) R18.2
N$13: J7.P18(CATHODE_YELLOW) R19.1
N$14: J7.P16(CATHODE_GREEN) R20.1
N$16: C23.1 J7.P4 J7.P5
RESERVED: R17.1 ; also sheet 1
SD_CLK: J5.5(CLK) ; also sheet 1
SD_CMD: J5.3(CMD) ; also sheet 1
SD_DAT0: J5.7(DAT0)
SD_DAT1: J5.8(DAT1)
SD_DAT2: J5.1(DAT2)
SD_DAT3: J5.2(CD/DAT3)
SD_PWR: C22.1
TR0_TAP: J7.P11(VC1) JP3.3
TR1_TAP: J7.P12(VC2) JP3.1
TR2_TAP: J7.P13(VC3) JP3.2
TR3_TAP: J7.P14(VC4) JP3.4
TRD0_N: IC5.4(D2+) J7.P2 ; also sheet 1
TRD0_P: IC5.5(D2-) J7.P1 ; also sheet 1
TRD1_N: IC5.2(D1-) J7.P6 ; also sheet 1
TRD1_P: IC5.1(D1+) J7.P3 ; also sheet 1
TRD2_N: IC4.4(D2+) J7.P8 ; also sheet 1
TRD2_P: IC4.5(D2-) J7.P7 ; also sheet 1
TRD3_N: IC4.2(D1-) J7.P10 ; also sheet 1
TRD3_P: IC4.1(D1+) J7.P9 ; also sheet 1
Unconnected: IC4.6(N.C._1) IC4.7(N.C._2) IC4.8(GND_2) IC4.9(N.C._3) IC4.10(N.C._4) IC5.6(N.C._1) IC5.7(N.C._2) IC5.8(GND_2) IC5.9(N.C._3) IC5.10(N.C._4)

### Notes on the sheet
- Only Populate 1
- 40 WAY GPIO HEADER
- ETHERNET CONNECTOR
- SD / ETHERNET / GPIO HEADERS
- SD-CARD

## Sheet 7 of 8: Real Time Clock and Fan Controller
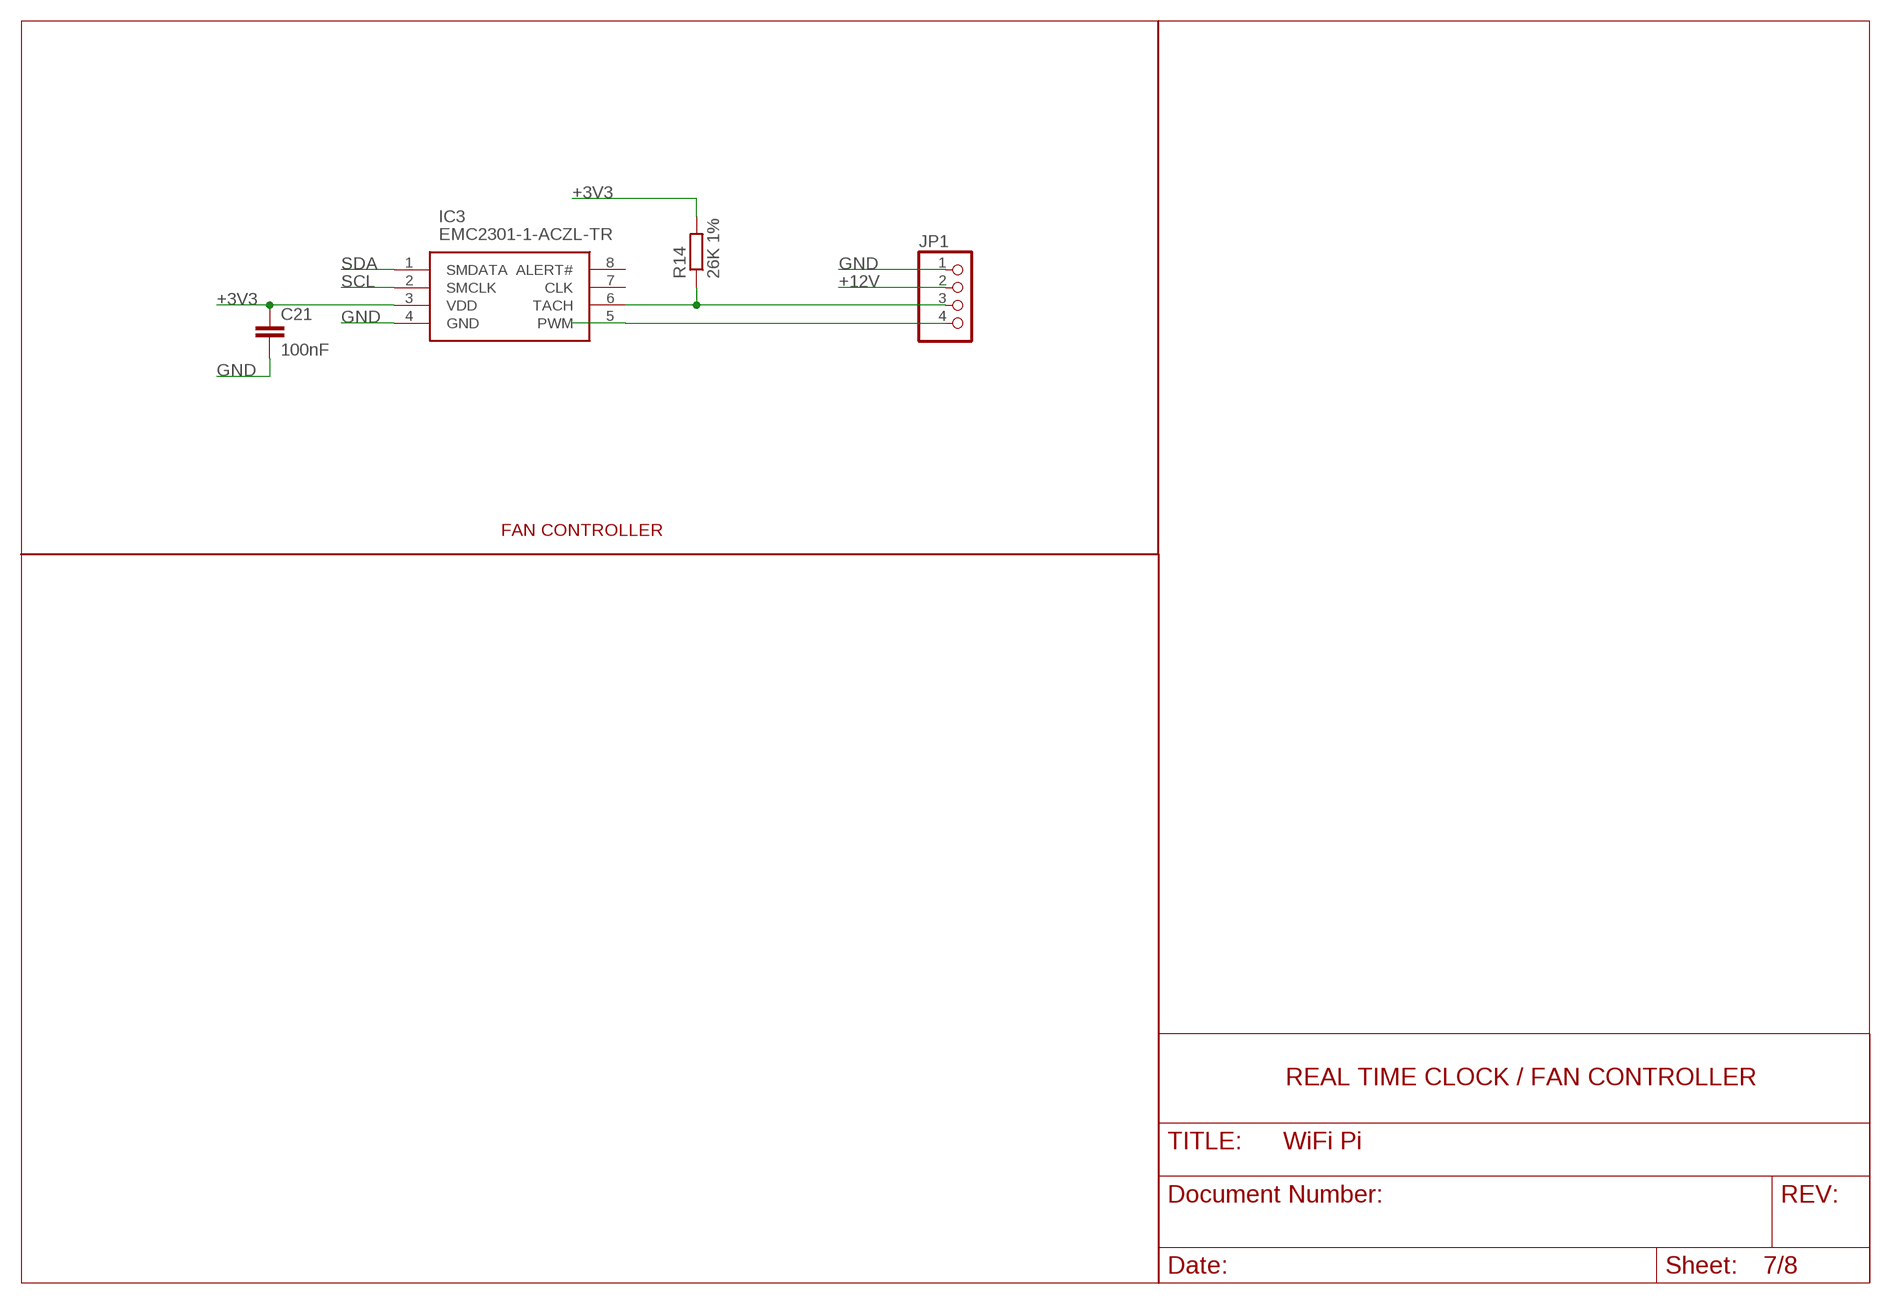
[diagram p6: schematic, sheet 7]

### Parts
C21  100nF  C-EUC0805K  [C0805K]
IC3  EMC2301-1-ACZL-TR  [SOP65P490X110-8N]
JP1  PINHD-1X4  [1X04]
R14  26K 1%  R-EU_M0805  [M0805]

### Nets
+3V3: C21.1 IC3.3(VDD) R14.2 ; also sheet 1,4,5,6,8
+12V: JP1.2 ; also sheet 2
GND: C21.2 IC3.4(GND) JP1.1 ; also sheet 1,2,4,5,6,8
N$9: IC3.5(PWM) JP1.4
N$10: IC3.6(TACH) JP1.3 R14.1
SCL: IC3.2(SMCLK)
SDA: IC3.1(SMDATA)
Unconnected: IC3.7(CLK) IC3.8(ALERT#)

### Notes on the sheet
- FAN CONTROLLER
- REAL TIME CLOCK / FAN CONTROLLER

## Sheet 8 of 8: Display and Camera
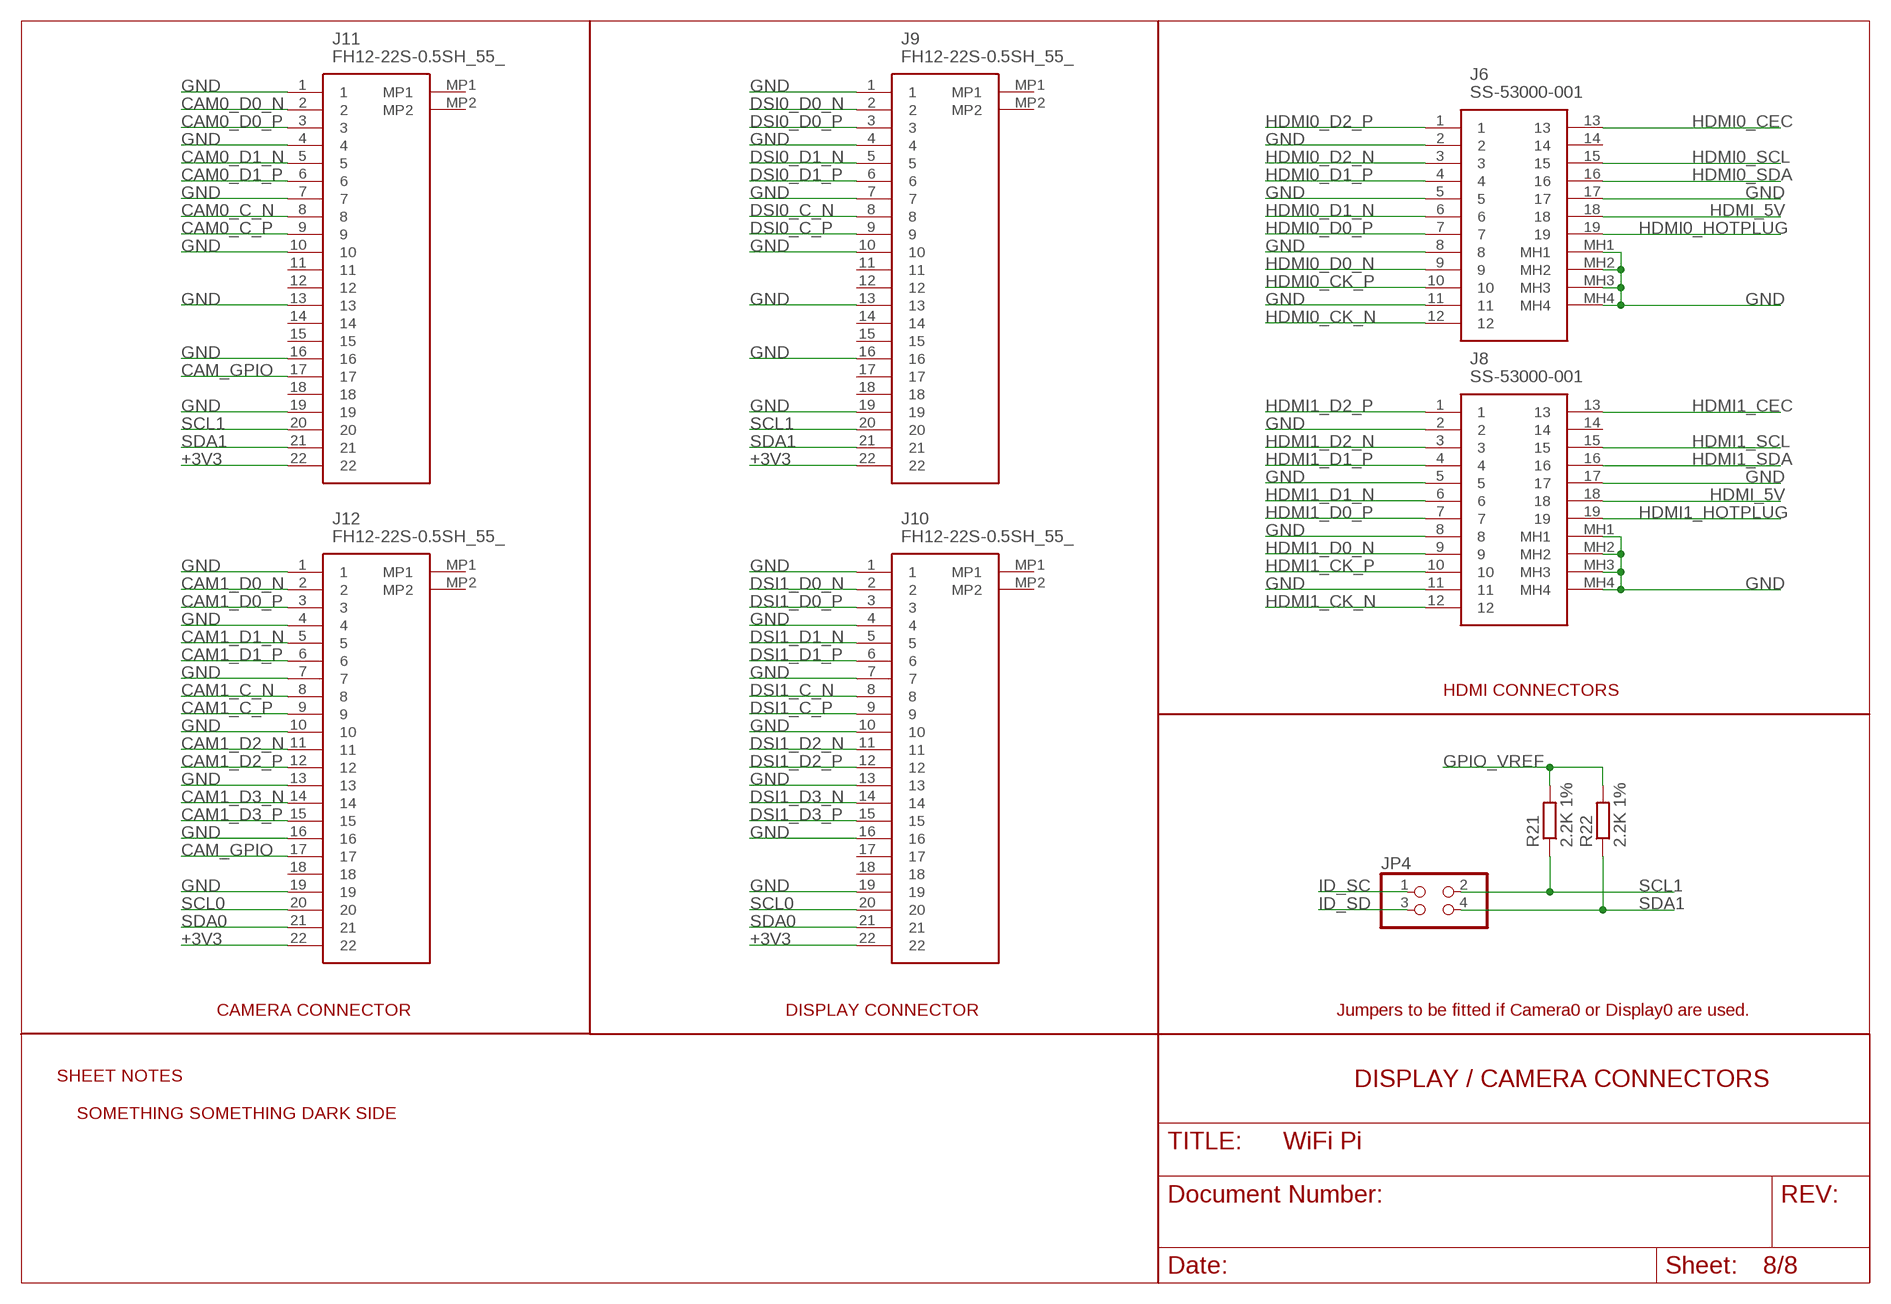
[diagram p7: schematic, sheet 8]

### Parts
J6  SS-53000-001  [SS53000001]
J8  SS-53000-001  [SS53000001]
J9  FH12-22S-0.5SH_55_  [FH1222S05SH55]
J10  FH12-22S-0.5SH_55_  [FH1222S05SH55]
J11  FH12-22S-0.5SH_55_  [FH1222S05SH55]
J12  FH12-22S-0.5SH_55_  [FH1222S05SH55]
JP4  PINHD-2X2  [2X02]
R21  2.2K 1%  R-EU_M0805  [M0805]
R22  2.2K 1%  R-EU_M0805  [M0805]

### Nets
+3V3: J9.22 J10.22 J11.22 J12.22 ; also sheet 1,4,5,6,7
CAM0_C_N: J11.8 ; also sheet 1
CAM0_C_P: J11.9 ; also sheet 1
CAM0_D0_N: J11.2 ; also sheet 1
CAM0_D0_P: J11.3 ; also sheet 1
CAM0_D1_N: J11.5 ; also sheet 1
CAM0_D1_P: J11.6 ; also sheet 1
CAM1_C_N: J12.8 ; also sheet 1
CAM1_C_P: J12.9 ; also sheet 1
CAM1_D0_N: J12.2 ; also sheet 1
CAM1_D0_P: J12.3 ; also sheet 1
CAM1_D1_N: J12.5 ; also sheet 1
CAM1_D1_P: J12.6 ; also sheet 1
CAM1_D2_N: J12.11 ; also sheet 1
CAM1_D2_P: J12.12 ; also sheet 1
CAM1_D3_N: J12.14 ; also sheet 1
CAM1_D3_P: J12.15 ; also sheet 1
CAM_GPIO: J11.17 J12.17 ; also sheet 1
DSI0_C_N: J9.8 ; also sheet 1
DSI0_C_P: J9.9 ; also sheet 1
DSI0_D0_N: J9.2 ; also sheet 1
DSI0_D0_P: J9.3 ; also sheet 1
DSI0_D1_N: J9.5 ; also sheet 1
DSI0_D1_P: J9.6 ; also sheet 1
DSI1_C_N: J10.8 ; also sheet 1
DSI1_C_P: J10.9 ; also sheet 1
DSI1_D0_N: J10.2 ; also sheet 1
DSI1_D0_P: J10.3 ; also sheet 1
DSI1_D1_N: J10.5 ; also sheet 1
DSI1_D1_P: J10.6 ; also sheet 1
DSI1_D2_N: J10.11 ; also sheet 1
DSI1_D2_P: J10.12 ; also sheet 1
DSI1_D3_N: J10.14 ; also sheet 1
DSI1_D3_P: J10.15 ; also sheet 1
GND: J6.2 J6.5 J6.8 J6.11 J6.17 J6.MH1 J6.MH2 J6.MH3 J6.MH4 J8.2 J8.5 J8.8 J8.11 J8.17 J8.MH1 J8.MH2 J8.MH3 J8.MH4 J9.1 J9.4 J9.7 J9.10 J9.13 J9.16 J9.19 J10.1 J10.4 J10.7 J10.10 J10.13 J10.16 J10.19 J11.1 J11.4 J11.7 J11.10 J11.13 J11.16 J11.19 J12.1 J12.4 J12.7 J12.10 J12.13 J12.16 J12.19 ; also sheet 1,2,4,5,6,7
GPIO_VREF: R21.2 R22.2 ; also sheet 1,6
HDMI0_CEC: J6.13 ; also sheet 1
HDMI0_CK_N: J6.12
HDMI0_CK_P: J6.10
HDMI0_D0_N: J6.9
HDMI0_D0_P: J6.7
HDMI0_D1_N: J6.6
HDMI0_D1_P: J6.4
HDMI0_D2_N: J6.3
HDMI0_D2_P: J6.1
HDMI0_HOTPLUG: J6.19 ; also sheet 1
HDMI0_SCL: J6.15
HDMI0_SDA: J6.16 ; also sheet 1
HDMI1_CEC: J8.13 ; also sheet 1
HDMI1_CK_N: J8.12
HDMI1_CK_P: J8.10
HDMI1_D0_N: J8.9
HDMI1_D0_P: J8.7
HDMI1_D1_N: J8.6
HDMI1_D1_P: J8.4
HDMI1_D2_N: J8.3
HDMI1_D2_P: J8.1
HDMI1_HOTPLUG: J8.19 ; also sheet 1
HDMI1_SCL: J8.15
HDMI1_SDA: J8.16 ; also sheet 1
HDMI_5V: J6.18 J8.18
ID_SC: JP4.1 ; also sheet 1,6
ID_SD: JP4.3 ; also sheet 1,6
SCL0: J10.20 J12.20 ; also sheet 1
SCL1: J9.20 J11.20 JP4.2 R21.1
SDA0: J10.21 J12.21 ; also sheet 1
SDA1: J9.21 J11.21 JP4.4 R22.1
Unconnected: J6.14 J8.14 J9.11 J9.12 J9.14 J9.15 J9.17 J9.18 J9.MP1 J9.MP2 J10.17 J10.18 J10.MP1 J10.MP2 J11.11 J11.12 J11.14 J11.15 J11.18 J11.MP1 J11.MP2 J12.18 J12.MP1 J12.MP2

### Notes on the sheet
- HDMI CONNECTORS
- CAMERA CONNECTOR | DISPLAY CONNECTOR | Jumpers to be fitted if Camera0 or Display0 are used.
- SHEET NOTES
  
      SOMETHING SOMETHING DARK SIDE
- DISPLAY / CAMERA CONNECTORS

## Power pins joined to a net without a drawn wire
VAUX33_REF: U4.E1(A:VAUX33_REF)
VDD15: U4.K4(A:VDD15) U4.P14(B:VDD15)
VDD15_2: U4.A4(A:VDD15_2) U4.M1(B:VDD15_2)
VDD15_3: U4.B2(A:VDD15_3) U4.M2(B:VDD15_3)
VDD15_4: U4.B3(A:VDD15_4) U4.N8(B:VDD15_4)
VDD15_5: U4.B7(A:VDD15_5) U4.P3(B:VDD15_5)
VDD15_6: U4.C5(A:VDD15_6) U4.P4(B:VDD15_6)
VDD15_7: U4.B10(B:VDD15_7) U4.F1(A:VDD15_7)
VDD15_8: U4.C11(B:VDD15_8) U4.F2(A:VDD15_8)
VDD15_9: U4.C13(B:VDD15_9) U4.H3(A:VDD15_9)
VDD15_10: U4.C14(B:VDD15_10)
VDD15_11: U4.E13(B:VDD15_11)
VDD15_12: U4.G13(B:VDD15_12)
VDD15_13: U4.L14(B:VDD15_13)
VDD15_14: U4.M11(B:VDD15_14)
VDD15_15: U4.M12(B:VDD15_15)
VDD15_16: U4.N10(B:VDD15_16)
VDD15_17: U4.N13(B:VDD15_17)
VDD15_18: U4.N14(B:VDD15_18)
VDD15_REF: U4.F3(A:VDD15_REF)
VDD33: U4.B4(A:VDD33) U4.P11(B:VDD33)
VDD33_2: U4.A3(A:VDD33_2) U4.M4(B:VDD33_2)
VDD33_3: U4.N1(B:VDD33_3)
VDD33_4: U4.A11(B:VDD33_4)
VDD33_5: U4.D12(B:VDD33_5)
VDD33_6: U4.K12(B:VDD33_6)
VDD33_REF: U4.E2(A:VDD33_REF)
VDD_COMB15: U4.C1(A:VDD_COMB15)
VDD_COMB33: U4.F4(A:VDD_COMB33)
VDD_COMBIO: U4.D3(A:VDD_COMBIO)
VDDA15: U4.J12(B:VDDA15) U4.L8(A:VDDA15)
VDDA15_2: U4.A7(A:VDDA15_2) U4.M6(B:VDDA15_2)
VDDA15_3: U4.D7(A:VDDA15_3) U4.M8(B:VDDA15_3)
VDDA15_4: U4.D8(A:VDDA15_4) U4.G11(B:VDDA15_4)
VDDA15_5: U4.D9(A:VDDA15_5) U4.G12(B:VDDA15_5)
VDDA15_6: U4.G4(A:VDDA15_6) U4.H11(B:VDDA15_6)
VDDA15_7: U4.H2(A:VDDA15_7) U4.J11(B:VDDA15_7)
VDDA15_8: U4.H4(A:VDDA15_8)
VDDA15_9: U4.J4(A:VDDA15_9)
VDDA15_10: U4.K3(A:VDDA15_10)
VDDA15_11: U4.L6(A:VDDA15_11)
VDDA15_12: U4.L7(A:VDDA15_12)
VDDA33: U4.J3(A:VDDA33)
VSS: U4.L5(A:VSS) U4.L11(B:VSS)
VSS_2: U4.D5(A:VSS_2) U4.M5(B:VSS_2)
VSS_3: U4.D6(A:VSS_3) U4.D10(B:VSS_3)
VSS_4: U4.D11(B:VSS_4) U4.E5(A:VSS_4)
VSS_5: U4.E6(A:VSS_5) U4.E10(B:VSS_5)
VSS_6: U4.E7(A:VSS_6) U4.E11(B:VSS_6)
VSS_7: U4.E8(A:VSS_7) U4.E12(B:VSS_7)
VSS_8: U4.E9(A:VSS_8) U4.F10(B:VSS_8)
VSS_9: U4.F5(A:VSS_9) U4.G10(B:VSS_9)
VSS_10: U4.F6(A:VSS_10) U4.H10(B:VSS_10)
VSS_11: U4.F7(A:VSS_11) U4.J10(B:VSS_11)
VSS_12: U4.F8(A:VSS_12) U4.K10(B:VSS_12)
VSS_13: U4.F9(A:VSS_13) U4.K11(B:VSS_13)
VSS_14: U4.G5(A:VSS_14) U4.L10(B:VSS_14)
VSS_15: U4.G6(A:VSS_15)
VSS_16: U4.G7(A:VSS_16)
VSS_17: U4.G8(A:VSS_17)
VSS_18: U4.G9(A:VSS_18)
VSS_19: U4.H5(A:VSS_19)
VSS_20: U4.H6(A:VSS_20)
VSS_21: U4.H7(A:VSS_21)
VSS_22: U4.H8(A:VSS_22)
VSS_23: U4.H9(A:VSS_23)
VSS_24: U4.J5(A:VSS_24)
VSS_25: U4.J6(A:VSS_25)
VSS_26: U4.J7(A:VSS_26)
VSS_27: U4.J8(A:VSS_27)
VSS_28: U4.J9(A:VSS_28)
VSS_29: U4.K2(A:VSS_29)
VSS_30: U4.K5(A:VSS_30)
VSS_31: U4.K6(A:VSS_31)
VSS_32: U4.K7(A:VSS_32)
VSS_33: U4.K8(A:VSS_33)
VSS_34: U4.K9(A:VSS_34)
VSS_35: U4.L4(A:VSS_35)
VSSA: U4.K1(A:VSSA) U4.P10(B:VSSA)
VSSA_2: U4.A5(A:VSSA_2) U4.L9(B:VSSA_2)
VSSA_3: U4.C7(A:VSSA_3) U4.M7(B:VSSA_3)
VSSA_4: U4.C8(A:VSSA_4) U4.M9(B:VSSA_4)
VSSA_5: U4.C9(A:VSSA_5) U4.N5(B:VSSA_5)
VSSA_6: U4.G3(A:VSSA_6) U4.N6(B:VSSA_6)
VSSA_7: U4.H1(A:VSSA_7) U4.P8(B:VSSA_7)
VSSA_8: U4.A10(B:VSSA_8)
VSSA_9: U4.E14(B:VSSA_9)
VSSA_10: U4.F11(B:VSSA_10)
VSSA_11: U4.F12(B:VSSA_11)
VSSA_12: U4.G14(B:VSSA_12)
VSSA_13: U4.H12(B:VSSA_13)
VSSA_14: U4.J13(B:VSSA_14)
VSSA_15: U4.K13(B:VSSA_15)
VSSA_REF: U4.E4(A:VSSA_REF)
VSSD_REF: U4.D1(A:VSSD_REF)

## Library data of the parts
C1-C39 = rcl:C-EU: CAPACITOR, European symbol; SPICEPREFIX: C
IC1 IC6 = AP64501SP-13:AP64501SP-13: Conv DC-DC 3.8V to 40V Synchronous Step Down Single-Out 0.8V to 39V 5A 8-Pin SO EP T/R Source: Datasheet <https://www.arrow.com/en/products/ap64501sp-13/diodes-incorporated>; ARROW_PART_NUMBER: AP64501SP-13; ARROW_PRICE-STOCK: https://www.arrow.com/en/products/ap64501sp-13/diodes-incorporated; DESCRIPTION: Conv DC-DC 3.8V to 40V Synchronous Step Down Single-Out 0.8V to 39V 5A 8-Pin SO EP T/R; HEIGHT: 1.63mm; MANUFACTURER_NAME: Diodes Inc.; MANUFACTURER_PART_NUMBER: AP64501SP-13; MOUSER_PART_NUMBER: 621-AP64501SP-13; MOUSER_PRICE-STOCK: https://www.mouser.co.uk/ProductDetail/Diodes-Incorporated/AP64501SP-13/?qs=P1JMDcb91o7FS0GU%252BW7TIQ%3D%3D
IC2 = XR22404CG28TR-F:XR22404CG28TR-F: IC USB 2.0 4-PORT HUB 28SSOP Source: Datasheet <https://www.maxlinear.com/document?id=22105>; DESCRIPTION: IC USB 2.0 4-PORT HUB 28SSOP; HEIGHT: 1.73mm; MANUFACTURER_NAME: MaxLinear, Inc.; MANUFACTURER_PART_NUMBER: XR22404CG28TR-F; MOUSER_PART_NUMBER: 701-XR22404CG28TR-F; MOUSER_PRICE-STOCK: https://www.mouser.co.uk/ProductDetail/MaxLinear/XR22404CG28TR-F?qs=pMEWzlIAYnay3yoEWcwQ0g%3D%3D
IC3 = EMC2301-1-ACZL-TR:EMC2301-1-ACZL-TR: RPM-Based PWM Fan Speed Controller MSOP8 Source: Datasheet <http://www.microchip.com/mymicrochip/filehandler.aspx?ddocname=en562400>; ARROW_PART_NUMBER: EMC2301-1-ACZL-TR; ARROW_PRICE-STOCK: https://www.arrow.com/en/products/emc2301-1-aczl-tr/microchip-technology; DESCRIPTION: RPM-Based PWM Fan Speed Controller MSOP8; HEIGHT: 1.1mm; MANUFACTURER_NAME: Microchip; MANUFACTURER_PART_NUMBER: EMC2301-1-ACZL-TR; MOUSER_PART_NUMBER: 886-EMC2301-1-ACZLTR; MOUSER_PRICE-STOCK: https://www.mouser.co.uk/ProductDetail/Microchip-Technology/EMC2301-1-ACZL-TR/?qs=pA5MXup5wxFdFYiBpDRrfw%3D%3D
IC4 IC5 = TPD4EUSB30DQAR:TPD4EUSB30DQAR: Texas Instruments TPD4EUSB30DQAR, USB Controller, 6Gbit/s, USB 3.0, 10-Pin SON Source: Datasheet <http://www.ti.com/lit/gpn/tpd4eusb30>; ARROW_PART_NUMBER: TPD4EUSB30DQAR; ARROW_PRICE-STOCK: https://www.arrow.com/en/products/tpd4eusb30dqar/texas-instruments; DESCRIPTION: Texas Instruments TPD4EUSB30DQAR, USB Controller, 6Gbit/s, USB 3.0, 10-Pin SON; HEIGHT: mm; MANUFACTURER_NAME: Texas Instruments; MANUFACTURER_PART_NUMBER: TPD4EUSB30DQAR; MOUSER_PART_NUMBER: 595-TPD4EUSB30DQAR; MOUSER_PRICE-STOCK: https://www.mouser.co.uk/ProductDetail/Texas-Instruments/TPD4EUSB30DQAR/?qs=Ze4%2FuFuz19JpY4uqYOLMbQ%3D%3D
J1 = PJ-079BH:PJ-079BH: DC Power Connectors power jack, 2.5 x 5.8 mm, horizontal, through hole, high current, w/ shielding,1 switch Source: Datasheet <http://www.mouser.com/datasheet/2/670/pj-079bh-1517209.pdf>; ARROW_PART_NUMBER: PJ-079BH; ARROW_PRICE-STOCK: https://www.arrow.com/en/products/pj-079bh/cui-devices; DESCRIPTION: DC Power Connectors power jack, 2.5 x 5.8 mm, horizontal, through hole, high current, w/ shielding,1 switch; HEIGHT: 7.3mm; MANUFACTURER_NAME: CUI Inc.; MANUFACTURER_PART_NUMBER: PJ-079BH; MOUSER_PART_NUMBER: 490-PJ-079BH; MOUSER_PRICE-STOCK: https://www.mouser.co.uk/ProductDetail/CUI-Devices/PJ-079BH?qs=l7cgNqFNU1gx%252Bc54Dso%252BFw%3D%3D
J2 = UJ31-CH-G2-SMT-TR:UJ31-CH-G2-SMT-TR: USB Connectors USB jack 3.1 C type 24pin Horz SMT Source: Datasheet <https://www.arrow.com/en/products/uj31-ch-g2-smt-tr/cui-devices>; ARROW_PART_NUMBER: UJ31-CH-G2-SMT-TR; ARROW_PRICE-STOCK: https://www.arrow.com/en/products/uj31-ch-g2-smt-tr/cui-devices; DESCRIPTION: USB Connectors USB jack 3.1 C type 24pin Horz SMT; HEIGHT: 4.66mm; MANUFACTURER_NAME: CUI Inc.; MANUFACTURER_PART_NUMBER: UJ31-CH-G2-SMT-TR; MOUSER_PART_NUMBER: 490-UJ31-CH-G2SMT-TR; MOUSER_PRICE-STOCK: https://www.mouser.co.uk/ProductDetail/CUI-Devices/UJ31-CH-G2-SMT-TR/?qs=W0yvOO0ixfGEsh2EYrPgIQ%3D%3D
J3 J4 = UJ2-ADH-1-TH:UJ2-ADH-1-TH: Standard A Type 8 Pin Horizontal 3 µin Plating Through Hole USB Jack 2.0 Check prices <https://pricing.snapeda.com/parts/UJ2-ADH-1-TH/CUI%20Devices/view-part?ref=eda>; MANUFACTURER: CUI Devices; STANDARD: Manufacturer Recommendations
J5 = 503398-1892:503398-1892: MicroSD SMT Push-Push 1.28mm height MicroSD SMT Push-Push 1.28mm height Source: Datasheet <http://www.molex.com/webdocs/datasheets/pdf/en-us//5033981892_MEMORY_CARD_SOCKET.pdf>; DESCRIPTION: MicroSD SMT Push-Push 1.28mm height MicroSD SMT Push-Push 1.28mm height; HEIGHT: mm; MANUFACTURER_NAME: Molex; MANUFACTURER_PART_NUMBER: 503398-1892; MOUSER_PART_NUMBER: 538-503398-1892; MOUSER_PRICE-STOCK: https://www.mouser.co.uk/ProductDetail/Molex/503398-1892?qs=b0v8CoHHvSMxV%252BW12iKaSg%3D%3D
J6 J8 = SS-53000-001:SS-53000-001: HDMI, Displayport & DVI Connectors HDMI RA W/Out Flange Source: Datasheet <https://componentsearchengine.com/Datasheets/1/SS-53000-001.pdf>; DESCRIPTION: HDMI, Displayport & DVI Connectors HDMI RA W/Out Flange; HEIGHT: 6.18mm; MANUFACTURER_NAME: Stewart Connector; MANUFACTURER_PART_NUMBER: SS-53000-001; MOUSER_PART_NUMBER: 530-SS-53000-001; MOUSER_PRICE-STOCK: https://www.mouser.co.uk/ProductDetail/Stewart-Connector-Bel/SS-53000-001/?qs=BJlw7L4Cy79s8HuVQy18%252BQ%3D%3D
J7 = 5-2337992-8:5-2337992-8: TE CONNECTIVITY - 5-2337992-8 - Modular Connector, RJ45 Jack, 1 x 1 Port, 8P8C, Cat5e, Through Hole Mount Source: Datasheet <https://www.te.com/commerce/DocumentDelivery/DDEController?Action=showdoc&DocId=Customer Drawing5-2337992-8ApdfEnglishENG_CD_5-2337992-8_A.pdf5-2337992-8>; DESCRIPTION: TE CONNECTIVITY - 5-2337992-8 - Modular Connector, RJ45 Jack, 1 x 1 Port, 8P8C, Cat5e, Through Hole Mount; HEIGHT: 13.65mm; MANUFACTURER_NAME: TE Connectivity; MANUFACTURER_PART_NUMBER: 5-2337992-8; MOUSER_PART_NUMBER: 571-5-2337992-8; MOUSER_PRICE-STOCK: https://www.mouser.co.uk/ProductDetail/TE-Connectivity/5-2337992-8?qs=l4Gc20tDgJIqFEPxQvwM3w%3D%3D
J9-J12 = FH12-22S-0.5SH_55_:FH12-22S-0.5SH_55_: Hirose FH12 Series 0.5mm Pitch 22 Way 1 Row Right Angle SMT Female FPC Connector, Gold Plated Contacts Source: Datasheet <https://www.hirose.com/product/download/?distributor=digikey&type=2d&lang=en&num=FH12-22S-0.5SH(55)>; DESCRIPTION: Hirose FH12 Series 0.5mm Pitch 22 Way 1 Row Right Angle SMT Female FPC Connector, Gold Plated Contacts; HEIGHT: 2.2mm; MANUFACTURER_NAME: Hirose; MANUFACTURER_PART_NUMBER: FH12-22S-0.5SH(55); MOUSER_PART_NUMBER: 798-FH12-22S-0.5SH55; MOUSER_PRICE-STOCK: https://www.mouser.co.uk/ProductDetail/Hirose-Connector/FH12-22S-05SH55/?qs=Ux3WWAnHpjDjN9JNAugKTA%3D%3D
J13-J16 = TE-E-KEY:2199230-2; BUILT_BY: EMA_Justin; COPYRIGHT: Copyright (C) 2018 Accelerated Designs. All rights reserved; DATASHEET: https://www.te.com/commerce/DocumentDelivery/DDEController?Action=showdoc&DocId=Customer+Drawing%7F2199230%7FB3%7Fpdf%7FEnglish%7FENG_CD_2199230_B3.pdf%7F1-2199230-6; MANUFACTURER_PART_NUMBER: 2199230-2; SOURCELIBRARY: TE_Connectivity-2018-03-16; VENDOR: TE Connectivity
JP1 = pinhead:PINHD-1X4: PIN HEADER
JP2 = pinhead:PINHD-2X20: PIN HEADER
JP3 JP4 = pinhead:PINHD-2X2: PIN HEADER
JP5 JP6 = pinhead:PINHD-1X3: PIN HEADER
JP7 = pinhead:PINHD-2X7: PIN HEADER
L1 L2 = SRN6045TA-3R3Y:SRN6045TA-3R3Y: BOURNS - SRN6045TA-3R3Y - INDUCTOR, AEC-Q200, 3.3UH, 5A, 30% Semi-shielded Power Inductors Source: Datasheet <http://www.bourns.com/docs/Product-Datasheets/SRN6045TA.pdf>; ARROW_PART_NUMBER: SRN6045TA-3R3Y; ARROW_PRICE-STOCK: https://www.arrow.com/en/products/srn6045ta-3r3y/bourns; DESCRIPTION: BOURNS - SRN6045TA-3R3Y - INDUCTOR, AEC-Q200, 3.3UH, 5A, 30% Semi-shielded Power Inductors; HEIGHT: 4.5mm; MANUFACTURER_NAME: Bourns; MANUFACTURER_PART_NUMBER: SRN6045TA-3R3Y; MOUSER_PART_NUMBER: 652-SRN6045TA-3R3Y; MOUSER_PRICE-STOCK: https://www.mouser.co.uk/ProductDetail/Bourns/SRN6045TA-3R3Y/?qs=Vt59ZOdFuWZ4MyJAxNBCDg%3D%3D
LED1 LED2 = led:LED: LED OSRAM: - CHIPLED LG R971, LG N971, LY N971, LG Q971, LY Q971, LO R971, LY R971 LH N974, LH R974 LS Q976, LO Q976, LY Q976 LO Q996 - Hyper CHIPLED LW Q18S LB Q993, LB Q99A, LB R99A - SideLED LS A670, LO A670, LY A670, LG A670, LP A670 LB A673, LV A673, LT A673, LW A673 LH A674 LY A675 LS A676, LA A676, LO A676, LY A676, LW A676 LS A679, LY A679, LG A679 - Hyper Micro SIDELED® LS Y876, LA Y876, LO Y876, LY Y876 LT Y87S - SmartLED LW L88C, LW L88S LB L89C, LB L89S, LG L890 LS L89K, LO L89K, LY L89K LS L896, LA L896, LO L896, LY L896 - TOPLED LS T670, LO T670, LY T670, LG T670, LP T670 LSG T670, LSP T670, LSY T670, LOP T670, LYG T670 LG T671, LOG T671, LSG T671 LB T673, LV T673, LT T673, LW T673 LH T674 LS T676, LA T676, LO T676, LY T676, LB T676, LH T676, LSB T676, LW T676 LB T67C, LV T67C, LT T67C, LS T67K, LO T67K, LY T67K, LW E67C LS E67B, LA E67B, LO E67B, LY E67B, LB E67C, LV E67C, LT E67C LW T67C LS T679, LY T679, LG T679 LS T770, LO T770, LY T770, LG T770, LP T770 LB T773, LV T773, LT T773, LW T773 LH T774 LS E675, LA E675, LY E675, LS T675 LS T776, LA T776, LO T776, LY T776, LB T776 LHGB T686 LT T68C, LB T68C - Hyper Mini TOPLED® LB M676 - Mini TOPLED Santana® LG M470 LS M47K, LO M47K, LY M47K Source: http://www.osram.convergy.de LUXEON: - LUMILED® LXK2-PW12-R00, LXK2-PW12-S00, LXK2-PW14-U00, LXK2-PW14-V00 LXK2-PM12-R00, LXK2-PM12-S00, LXK2-PM14-U00 LXK2-PE12-Q00, LXK2-PE12-R00, LXK2-PE12-S00, LXK2-PE14-T00, LXK2-PE14-U00 LXK2-PB12-K00, LXK2-PB12-L00, LXK2-PB12-M00, LXK2-PB14-N00, LXK2-PB14-P00, LXK2-PB14-Q00 LXK2-PR12-L00, LXK2-PR12-M00, LXK2-PR14-Q00, LXK2-PR14-R00 LXK2-PD12-Q00, LXK2-PD12-R00, LXK2-PD12-S00 LXK2-PH12-R00, LXK2-PH12-S00 LXK2-PL12-P00, LXK2-PL12-Q00, LXK2-PL12-R00 Source: www.luxeon.com KINGBRIGHT: KA-3528ASYC Source: www.kingbright.com
Q1 = DMP3013SFV-7:DMP3013SFV-7: Trans MOSFET P-CH 30V 12A 8-Pin PowerDI EP T/R Source: Datasheet <https://4donline.ihs.com/images/VipMasterIC/IC/DIOD/DIOD-S-A0008513542/DIOD-S-A0008513542-1.pdf?hkey=52A5661711E402568146F3353EA87419>; ARROW_PART_NUMBER: DMP3013SFV-7; ARROW_PRICE-STOCK: https://www.arrow.com/en/products/dmp3013sfv-7/diodes-incorporated; DESCRIPTION: Trans MOSFET P-CH 30V 12A 8-Pin PowerDI EP T/R; HEIGHT: 0.85mm; MANUFACTURER_NAME: Diodes Inc.; MANUFACTURER_PART_NUMBER: DMP3013SFV-7; MOUSER_PART_NUMBER: 621-DMP3013SFV-7; MOUSER_PRICE-STOCK: https://www.mouser.co.uk/ProductDetail/Diodes-Incorporated/DMP3013SFV-7?qs=W0yvOO0ixfH1hnmiAtL1VQ%3D%3D
R1-R28 = rcl:R-EU_: RESISTOR, European symbol; SPICEPREFIX: R
RPI-CM1 = RPI-CM4:RPI-CM4
U1 = FSUSB42MUX:FSUSB42MUX: ON SEMICONDUCTOR - FSUSB42MUX - USB SWITCH, DUAL, DPDT, MSOP-10 Source: Datasheet <https://componentsearchengine.com/Datasheets/2/FSUSB42MUX.pdf>; ARROW_PART_NUMBER: FSUSB42MUX; ARROW_PRICE-STOCK: https://www.arrow.com/en/products/fsusb42mux/on-semiconductor; DESCRIPTION: ON SEMICONDUCTOR - FSUSB42MUX - USB SWITCH, DUAL, DPDT, MSOP-10; HEIGHT: 1.1mm; MANUFACTURER_NAME: ON Semiconductor; MANUFACTURER_PART_NUMBER: FSUSB42MUX; MOUSER_PART_NUMBER: 512-FSUSB42MUX; MOUSER_PRICE-STOCK: https://www.mouser.co.uk/ProductDetail/ON-Semiconductor-Fairchild/FSUSB42MUX?qs=yA6kp8fx8Y59RAD4iJDRWg%3D%3D
U2 U3 = 74LVC1G07SE-7:74LVC1G07SE-7: Buffers & Line Drivers Single Gate Open Out 1.65 to 5.5V 32mA Source: Datasheet <https://componentsearchengine.com/Datasheets/2/74LVC1G07SE-7.pdf>; ARROW_PART_NUMBER: 74LVC1G07SE-7; ARROW_PRICE-STOCK: https://www.arrow.com/en/products/74lvc1g07se-7/diodes-incorporated; DESCRIPTION: Buffers & Line Drivers Single Gate Open Out 1.65 to 5.5V 32mA; HEIGHT: 1.1mm; MANUFACTURER_NAME: Diodes Inc.; MANUFACTURER_PART_NUMBER: 74LVC1G07SE-7; MOUSER_PART_NUMBER: 621-74LVC1G07SE-7; MOUSER_PRICE-STOCK: https://www.mouser.co.uk/ProductDetail/Diodes-Incorporated/74LVC1G07SE-7/?qs=abZ1nkZpTuNoZmx9wrxFdA%3D%3D
U4 = Xio31307hc:XIO3130ZHC; DATASHEET_URL: http://www.ti.com/lit/gpn/XIO3130; DESCRIPTION: x1 PCI Express 4-Port 4-Lane Packet Switch; FAMILY_NAME: PCIE SWITCH; GENERIC_PART_NUMBER: XIO3130; INDUSTRY_STD_PKG_TYPE: BGA MICROSTAR; MANUFACTURER: Texas Instruments; MANUFACTURER_PART_NUMBER: XIO3130ZHC; PACKAGE_DESIGNATOR: ZHC; PIN_COUNT: 196; VENDOR: Texas Instruments
Y1 = ABM8-12.000MHz-B2-T:ABM8-12.000MHZ-B2-T: ABRACON - ABM8-12.000MHZ-B2-T - Crystal, 12 MHz, SMD, 3.2mm x 2.5mm, 50 ppm, 18 pF, 20 ppm, ABM8 Series Source: Datasheet <https://datasheet.datasheetarchive.com/originals/dk/DKDS41/DSANUWW0031052.pdf>; ARROW_PART_NUMBER: ABM8-12.000MHZ-B2-T; ARROW_PRICE-STOCK: https://www.arrow.com/en/products/abm8-12.000mhz-b2-t/abracon; DESCRIPTION: ABRACON - ABM8-12.000MHZ-B2-T - Crystal, 12 MHz, SMD, 3.2mm x 2.5mm, 50 ppm, 18 pF, 20 ppm, ABM8 Series; HEIGHT: 0.8mm; MANUFACTURER_NAME: ABRACON; MANUFACTURER_PART_NUMBER: ABM8-12.000MHz-B2-T; MOUSER_PART_NUMBER: 815-ABM8-12-B2-T; MOUSER_PRICE-STOCK: https://www.mouser.co.uk/ProductDetail/ABRACON/ABM8-12000MHZ-B2-T?qs=hjiqo2PPvpiyy6%252BNWm3IZg%3D%3D
Z1 = MMBZ5242BLT3G:MMBZ5242BLT3G: Zener Diodes ZEN SOT23 REG .225W 12V Source: Datasheet <http://www.onsemi.com/pub/Collateral/MMBZ5221BLT1-D.PDF>; ARROW_PART_NUMBER: MMBZ5242BLT3G; ARROW_PRICE-STOCK: https://www.arrow.com/en/products/mmbz5242blt3g/on-semiconductor; DESCRIPTION: Zener Diodes ZEN SOT23 REG .225W 12V; HEIGHT: 1.11mm; MANUFACTURER_NAME: ON Semiconductor; MANUFACTURER_PART_NUMBER: MMBZ5242BLT3G; MOUSER_PART_NUMBER: 863-MMBZ5242BLT3G; MOUSER_PRICE-STOCK: https://www.mouser.co.uk/ProductDetail/ON-Semiconductor/MMBZ5242BLT3G/?qs=P4IOph%252Bbot8zm7%252BOlKh6Qw%3D%3D